# EAGLE board tc08-3-21 (EAGLE 6.6.0), part 1 of 10
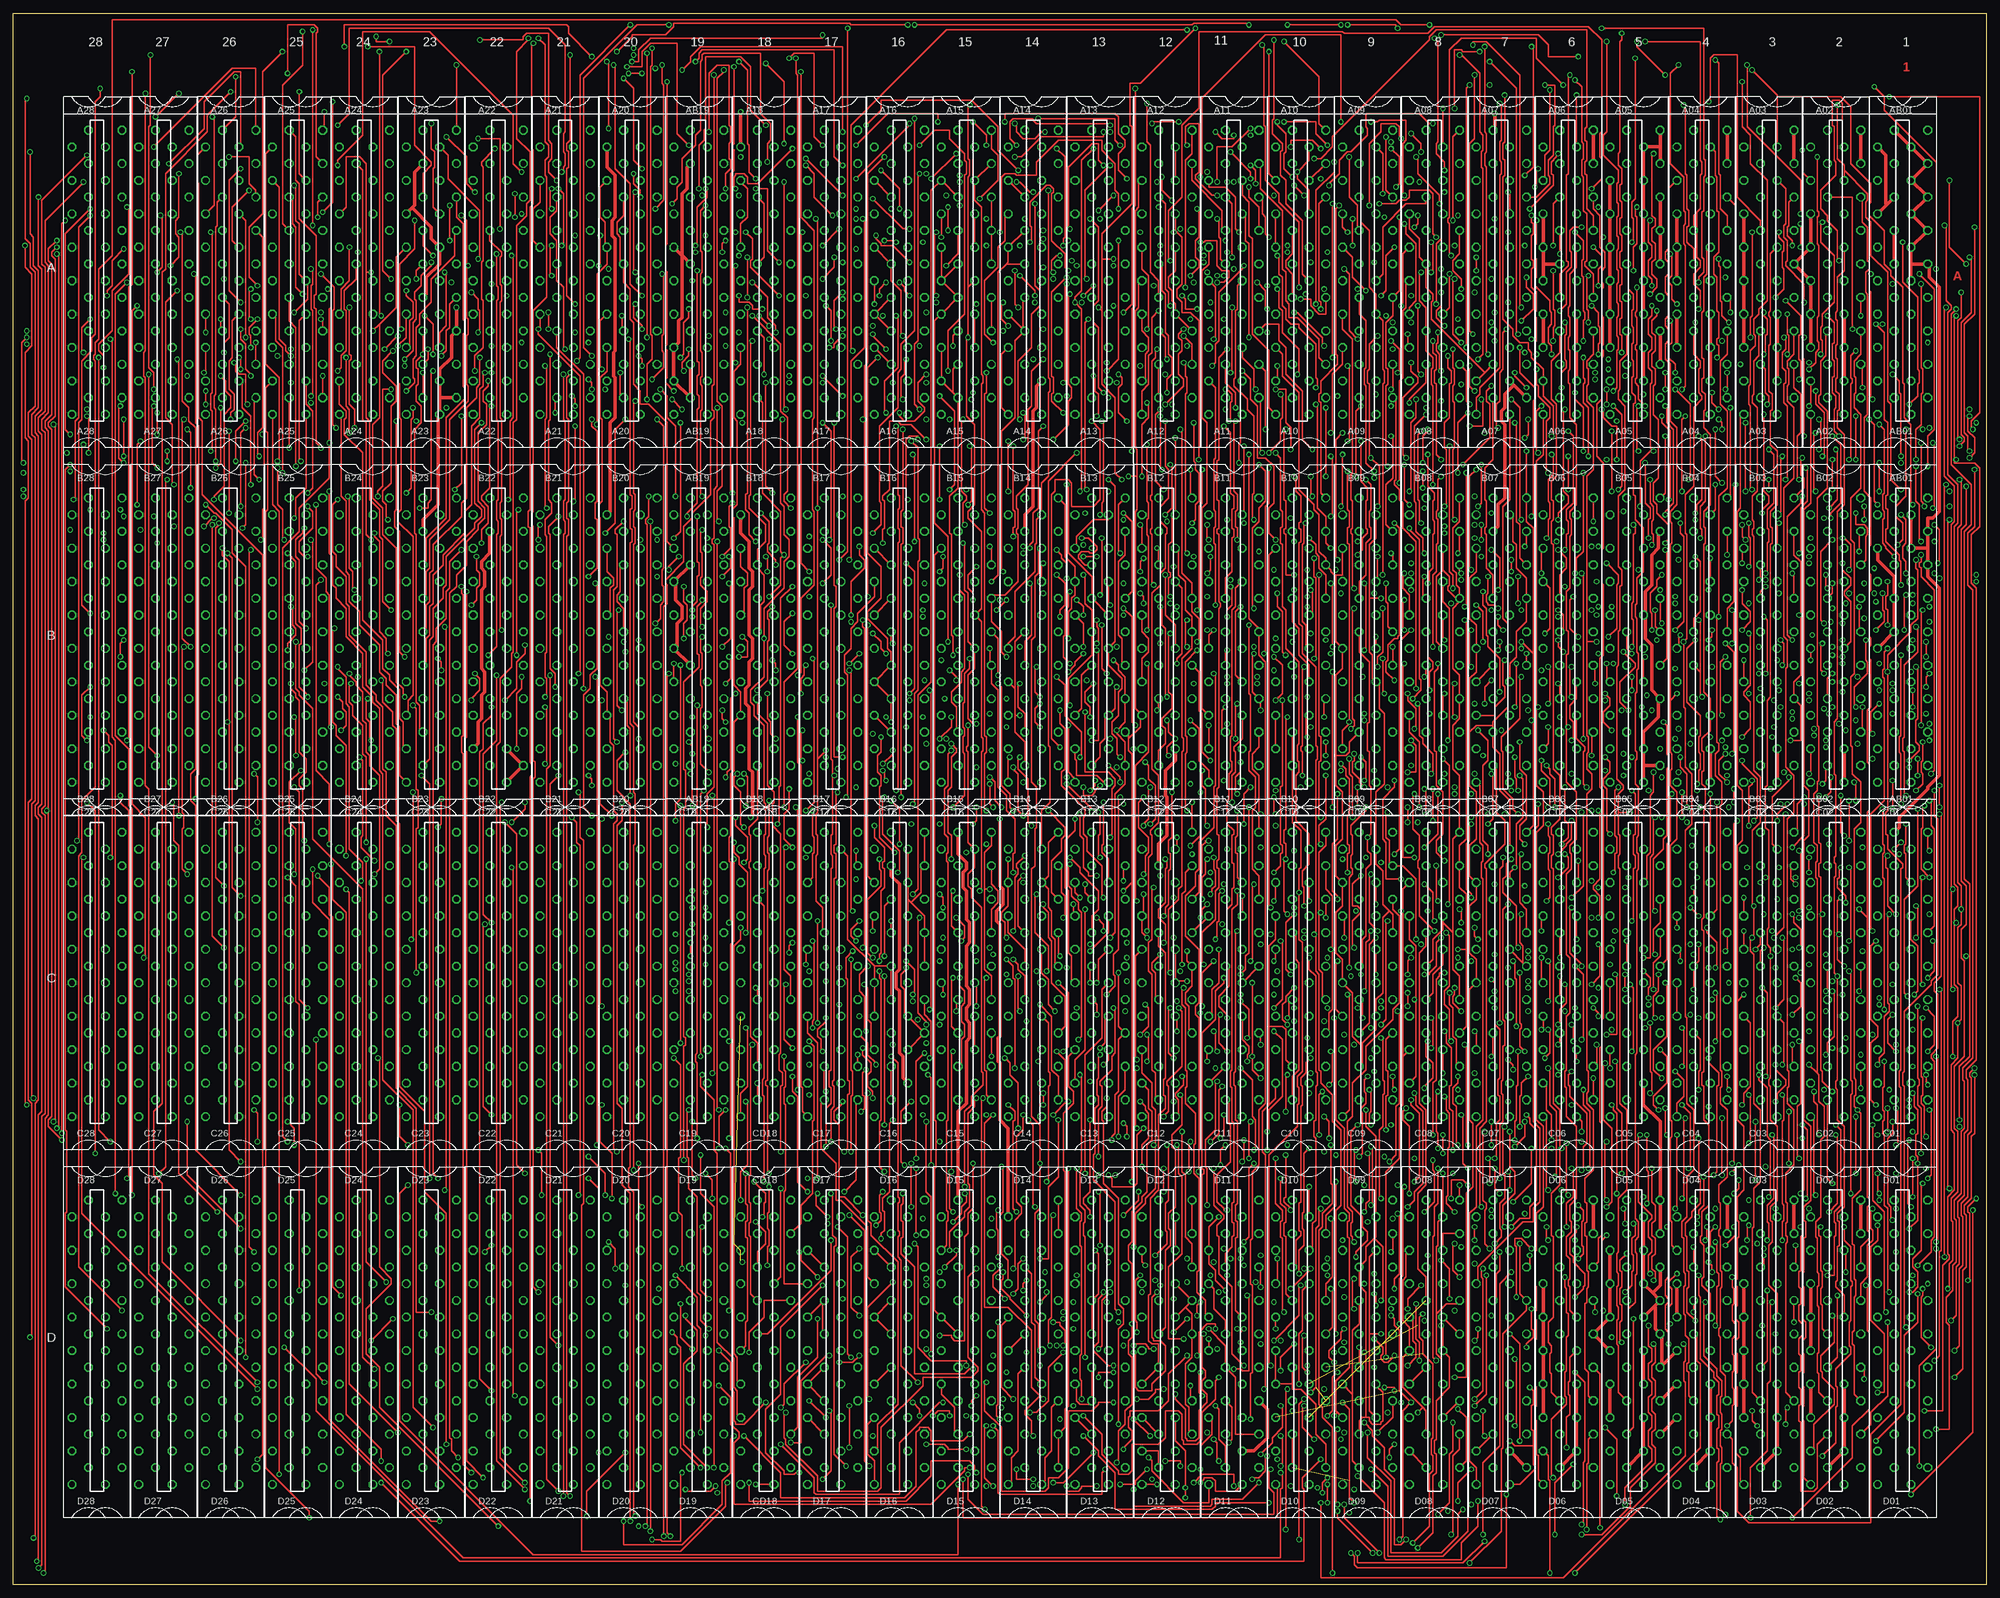
[diagram p12: board, top side]
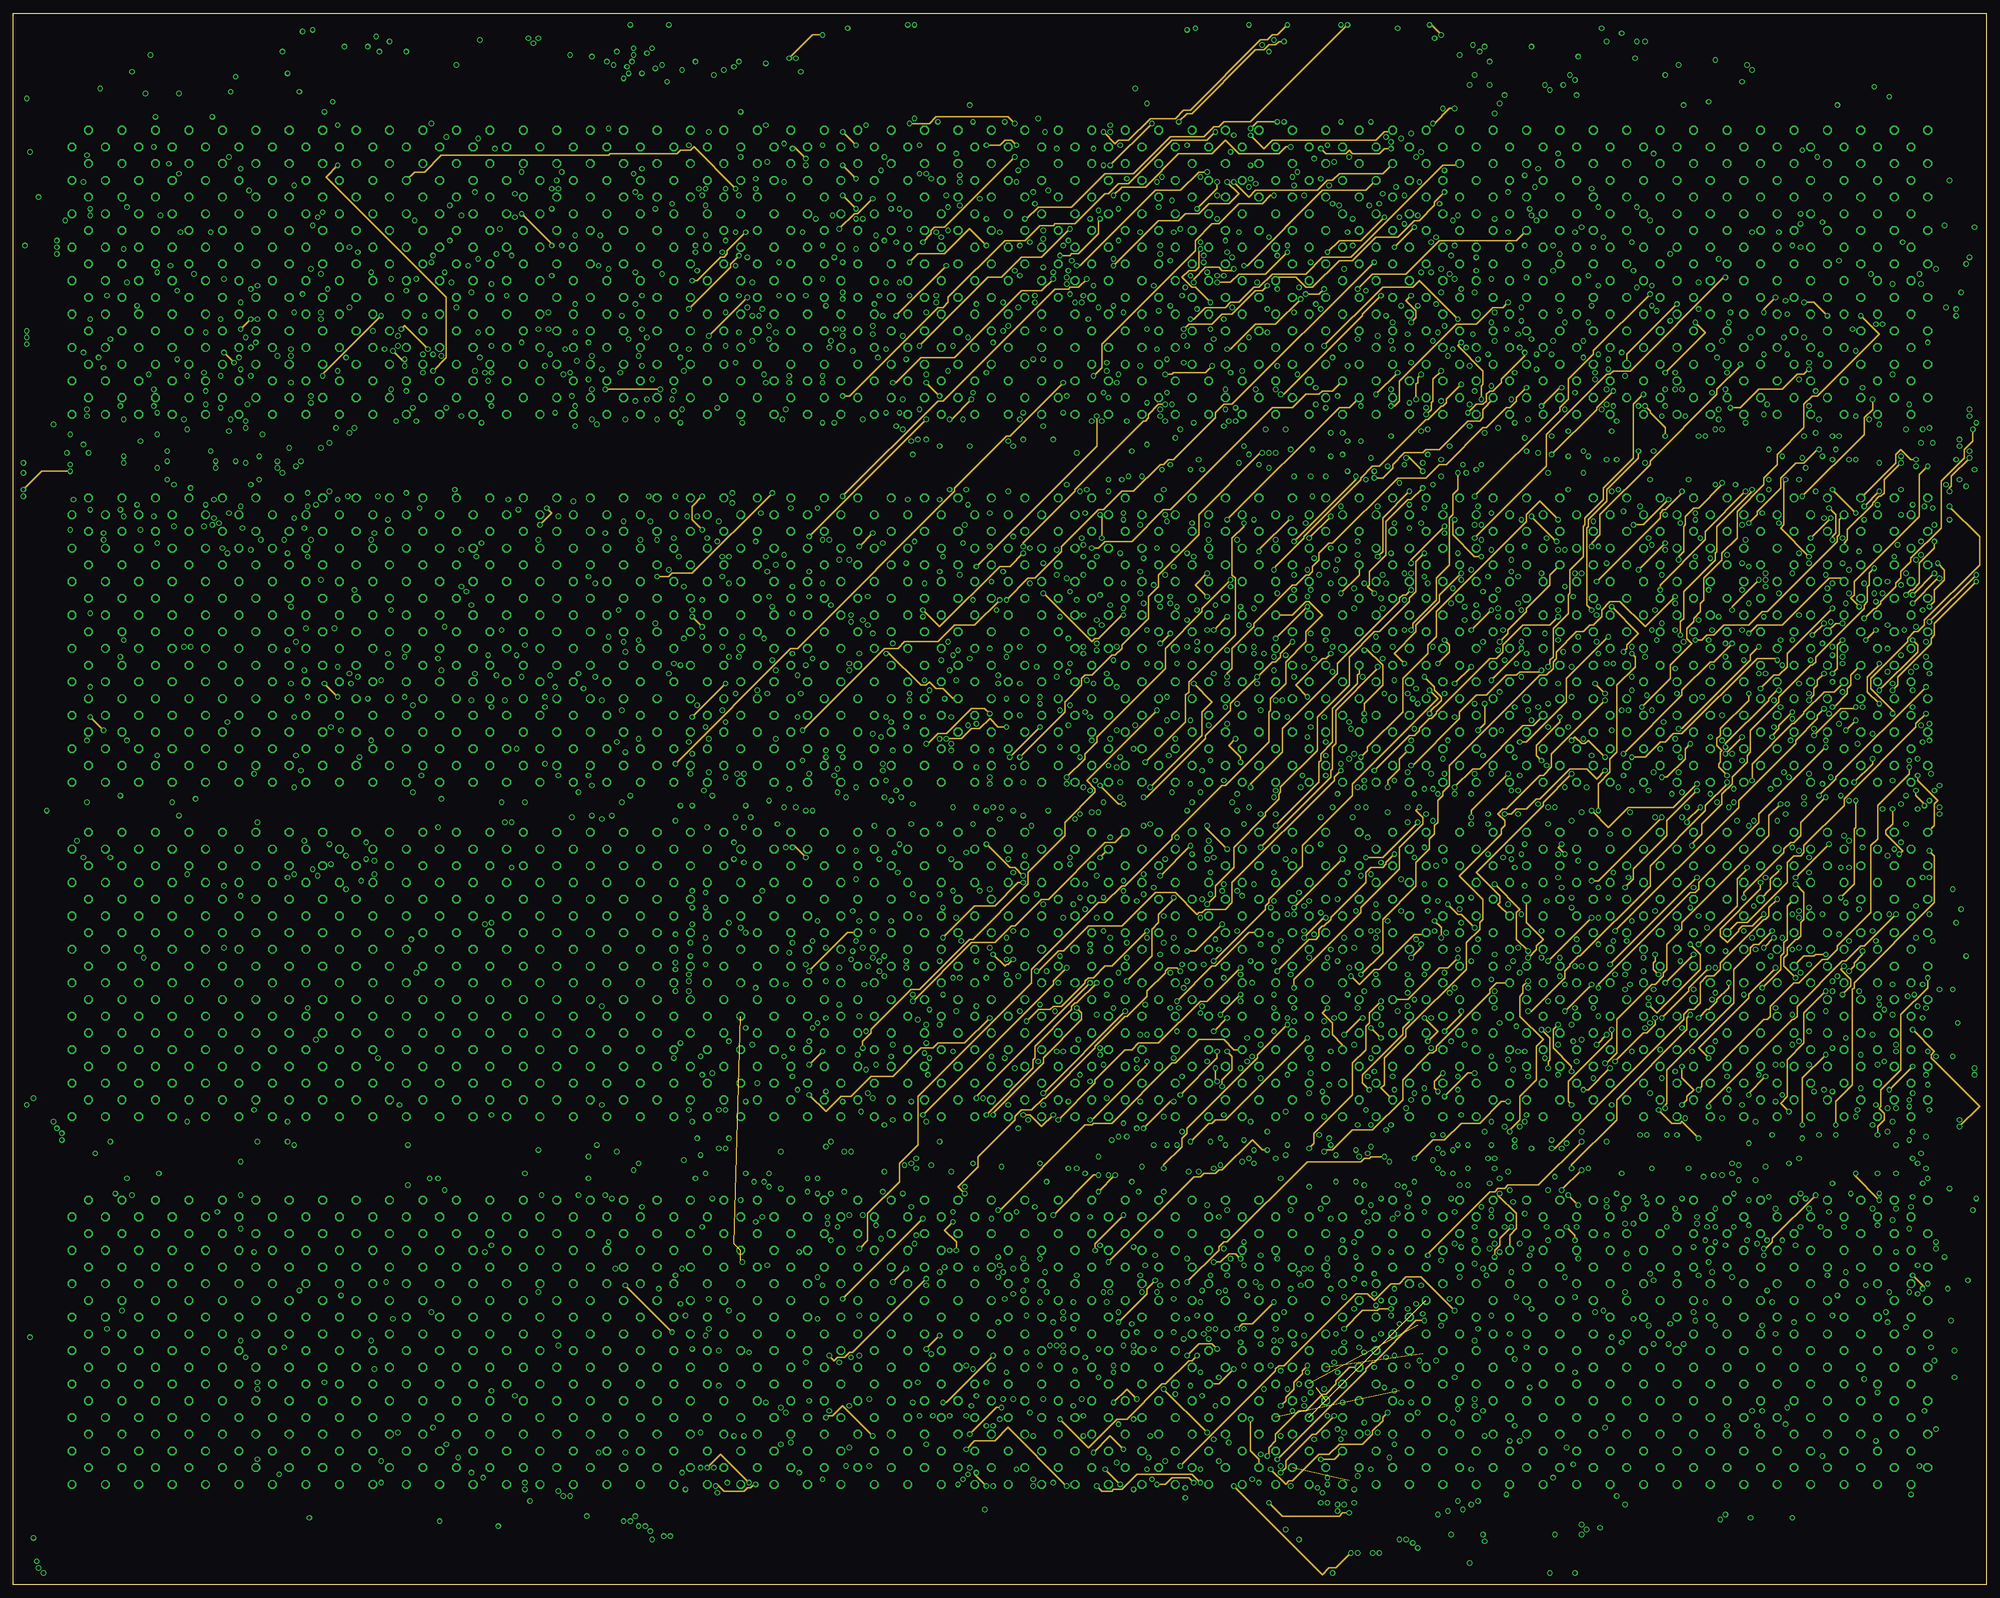
[diagram p13: board, inner layer Route2]
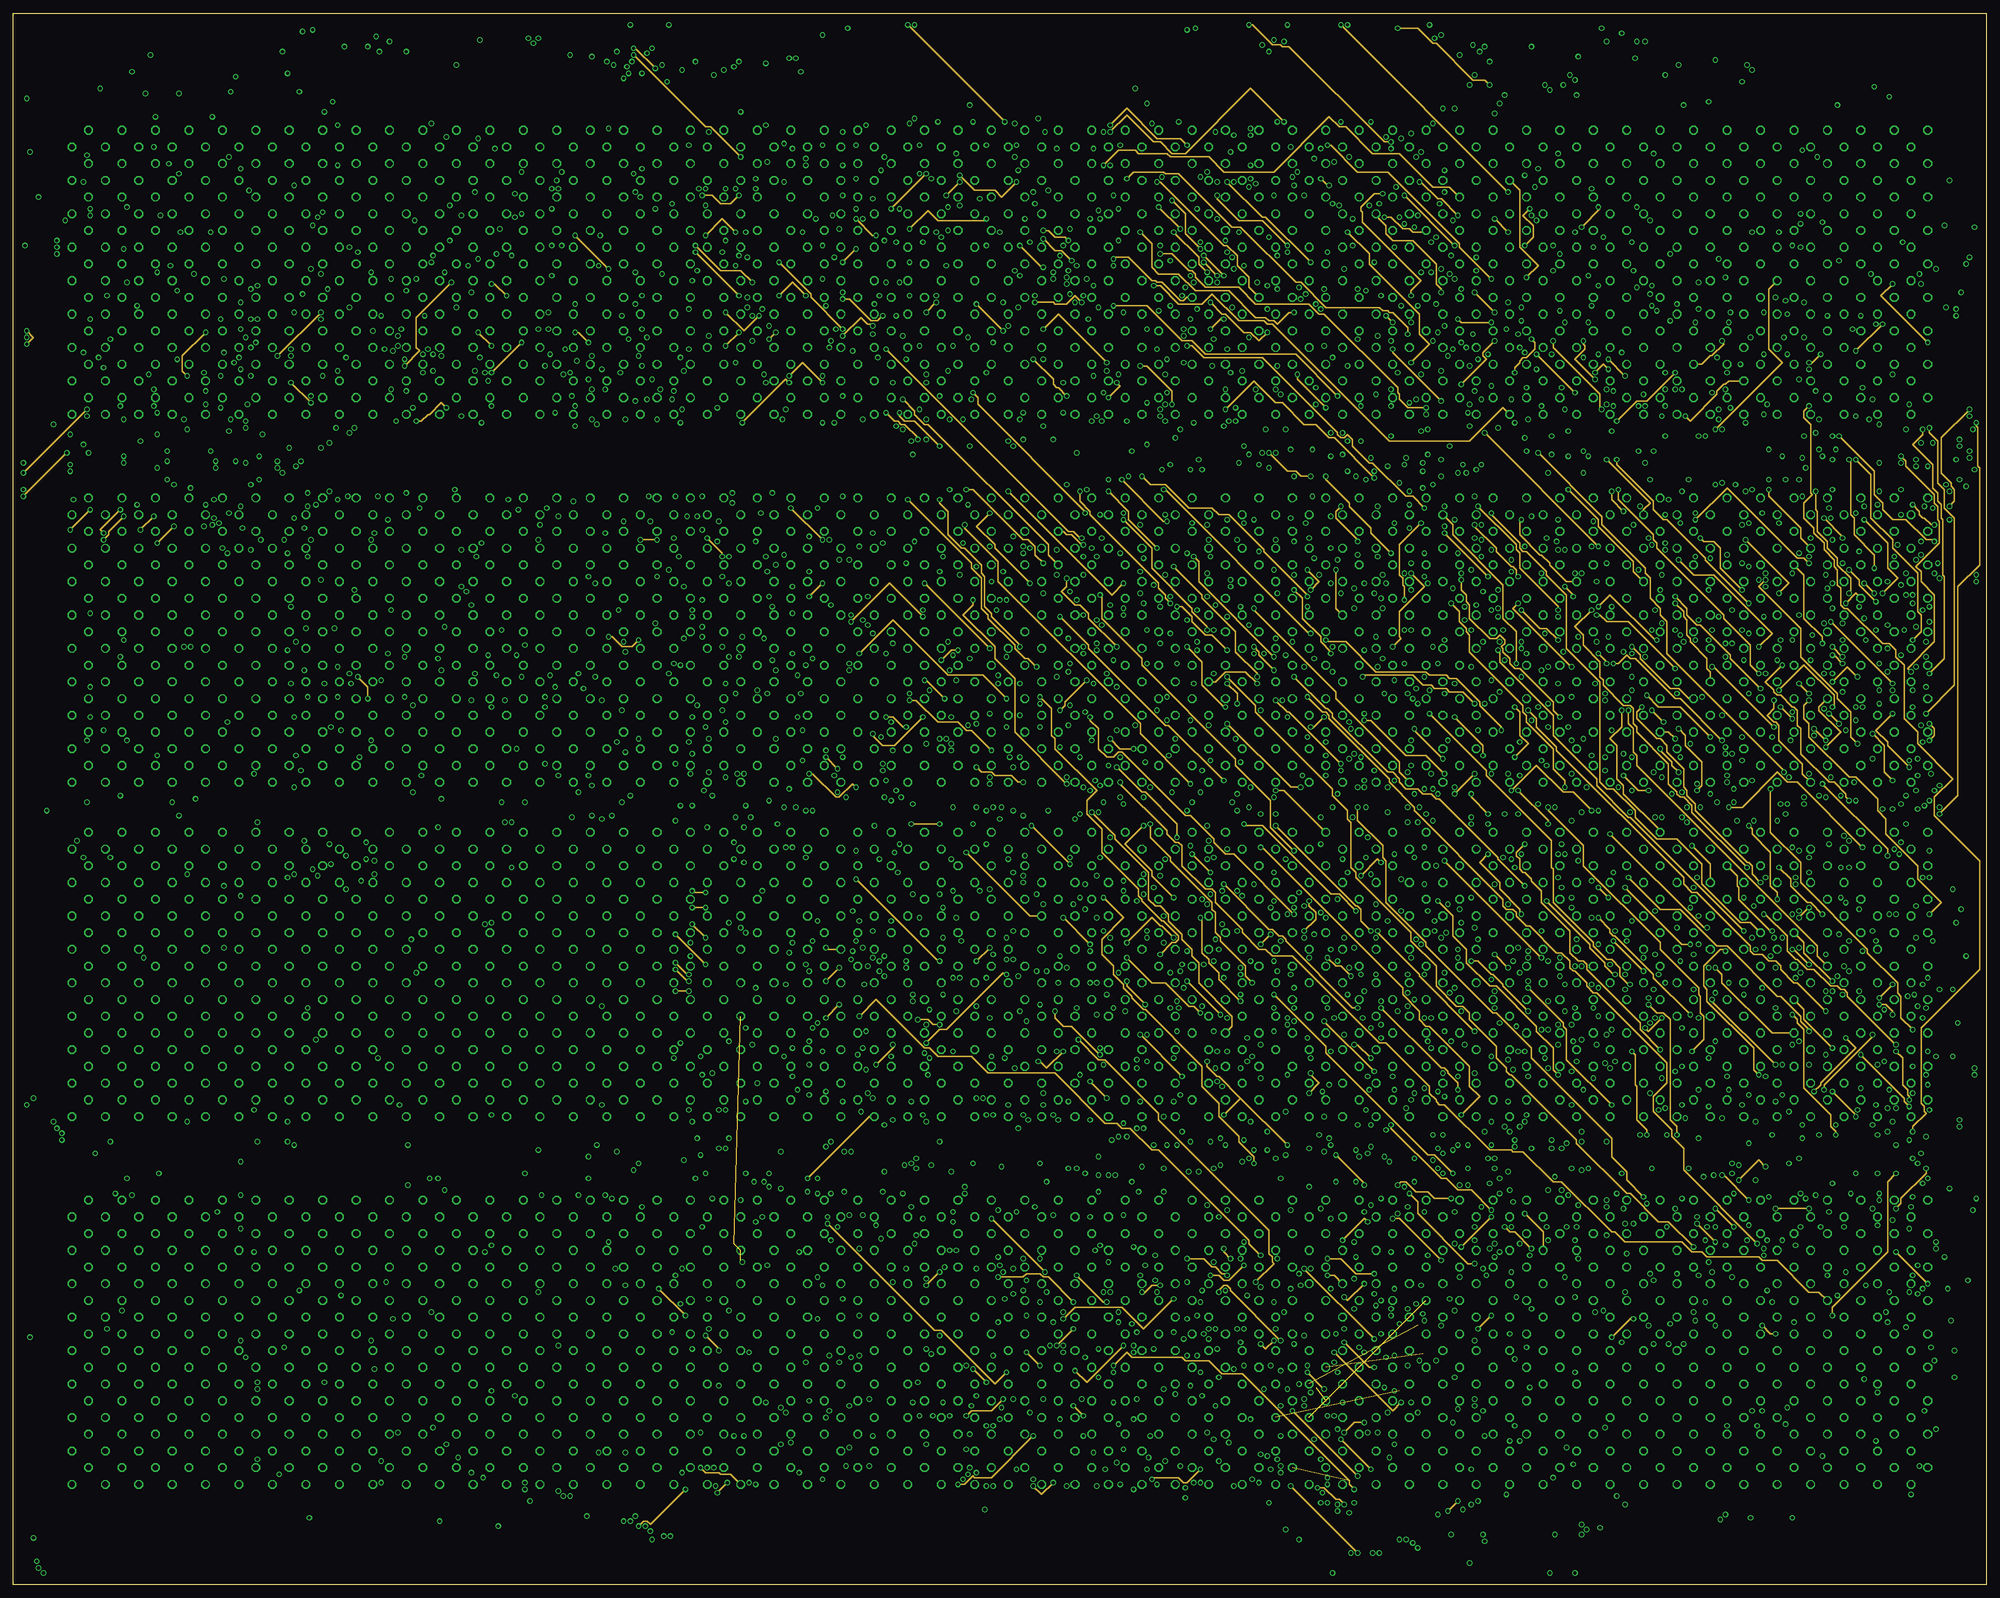
[diagram p14: board, inner layer Route15]
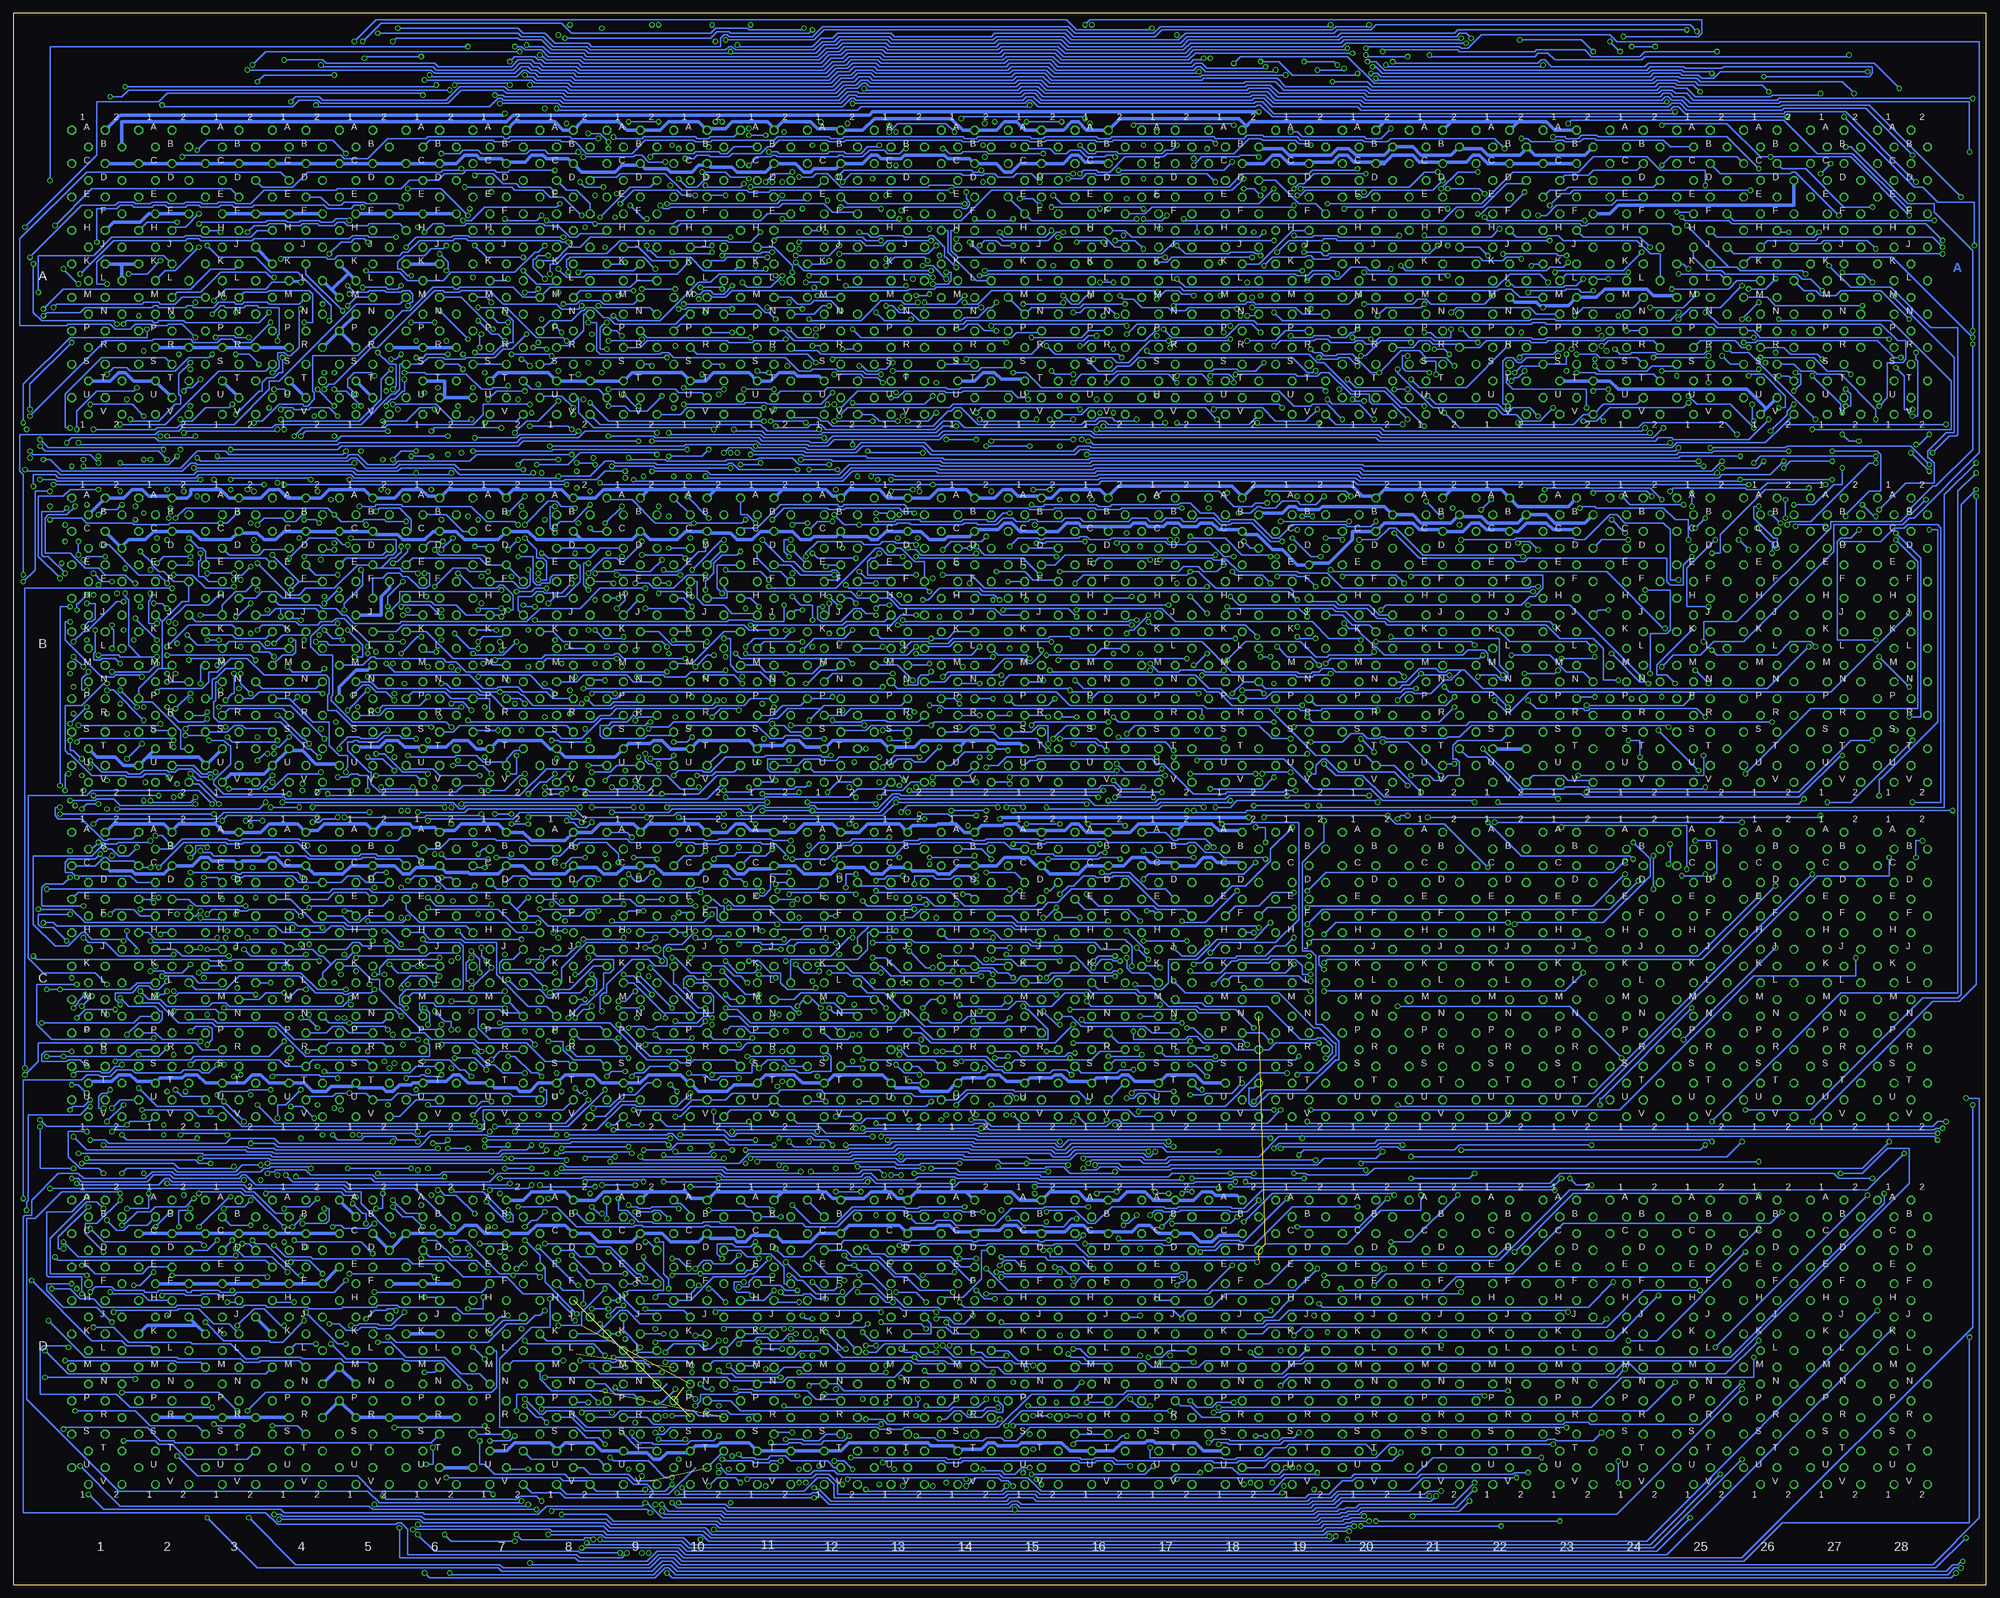
[diagram p15: board, bottom side, seen from below]

Size 374.71 x 298.44 mm. Coordinates in mm from the lower left corner, seen from the top.
Outline: 374.68,0 0,0 0.03,298.42 374.71,298.44 374.68,0
Copper layers (1*2*15*16): Top 0.035mm / dielectric 1.5mm / Route2 0.035mm / dielectric 0.15mm / Route15 0.035mm / dielectric 0.2mm / Bottom 0.035mm
Design rules "10mils": minimum track width 10mil, minimum drill 24mil, track to track 10mil, track to pad 10mil, pad to pad 10mil, via to via 10mil, smd to smd 10mil, copper to edge 40mil, drill to drill 10mil, minimum pad ring 10mil, minimum via ring 8mil, stop-mask expansion 0mil, vias tented up to drill 0mil, thermal gap 10mil
Net classes: 1 Power: width 0.635 mm, drill 0.381 mm, clearance 0.381 mm

## Footprints (pad centres in the part's own frame; a part is rotated, then mirrored left to right if it is on the bottom)
H807 = drill 1.092 octagon: A1 4.763,28.575; A2 -1.587,28.575; B1 1.587,25.4; B2 -4.763,25.4; C1 4.763,22.225; C2 -1.587,22.225; D1 1.587,19.05; D2 -4.763,19.05; E1 4.763,15.875; E2 -1.587,15.875; F1 1.587,12.7; F2 -4.763,12.7; H1 4.763,9.525; H2 -1.587,9.525; J1 1.587,6.35; J2 -4.763,6.35; K1 4.763,3.175; K2 -1.587,3.175; L1 1.587,0; L2 -4.763,0; M1 4.763,-3.175; M2 -1.587,-3.175; N1 1.587,-6.35; N2 -4.763,-6.35; P1 4.763,-9.525; P2 -1.587,-9.525; R1 1.587,-12.7; R2 -4.763,-12.7; S1 4.763,-15.875; S2 -1.587,-15.875; T1 1.587,-19.05; T2 -4.763,-19.05; U1 4.763,-22.225; U2 -1.587,-22.225; V1 1.587,-25.4; V2 -4.763,-25.4
H807-2 = drill 1.092 octagon: AA1 4.763,60.325; AA2 -1.587,60.325; AB1 1.587,57.15; AB2 -4.763,57.15; AC1 4.763,53.975; AC2 -1.587,53.975; AD1 1.587,50.8; AD2 -4.763,50.8; AE1 4.763,47.625; AE2 -1.587,47.625; AF1 1.587,44.45; AF2 -4.763,44.45; AH1 4.763,41.275; AH2 -1.587,41.275; AJ1 1.587,38.1; AJ2 -4.763,38.1; AK1 4.763,34.925; AK2 -1.587,34.925; AL1 1.587,31.75; AL2 -4.763,31.75; AM1 4.763,28.575; AM2 -1.587,28.575; AN1 1.587,25.4; AN2 -4.763,25.4; AP1 4.763,22.225; AP2 -1.587,22.225; AR1 1.587,19.05; AR2 -4.763,19.05; AS1 4.763,15.875; AS2 -1.587,15.875; AT1 1.587,12.7; AT2 -4.763,12.7; AU1 4.763,9.525; AU2 -1.587,9.525; AV1 1.587,6.35; AV2 -4.763,6.35; BA1 4.763,-9.525; BA2 -1.587,-9.525; BB1 1.587,-12.7; BB2 -4.763,-12.7; BC1 4.763,-15.875; BC2 -1.587,-15.875; BD1 1.587,-19.05; BD2 -4.763,-19.05; BE1 4.763,-22.225; BE2 -1.587,-22.225; BF1 1.587,-25.4; BF2 -4.763,-25.4; BH1 4.763,-28.575; BH2 -1.587,-28.575; BJ1 1.587,-31.75; BJ2 -4.763,-31.75; BK1 4.763,-34.925; BK2 -1.587,-34.925; BL1 1.587,-38.1; BL2 -4.763,-38.1; BM1 4.763,-41.275; BM2 -1.587,-41.275; BN1 1.587,-44.45; BN2 -4.763,-44.45; BP1 4.763,-47.625; BP2 -1.587,-47.625; BR1 1.587,-50.8; BR2 -4.763,-50.8; BS1 4.763,-53.975; BS2 -1.587,-53.975; BT1 1.587,-57.15; BT2 -4.763,-57.15; BU1 4.763,-60.325; BU2 -1.587,-60.325; BV1 1.587,-63.5; BV2 -4.763,-63.5

## Placement (x,y rotation side)
A02  M903  [H807]  346.11,247.64 0 top
A03  M903  [H807]  333.41,247.64 0 top
A04  M903  [H807]  320.71,247.64 0 top
A05  M903  [H807]  308.01,247.64 0 top
A06  M903  [H807]  295.31,247.64 0 top
A07  M161  [H807]  282.61,247.64 0 top
A08  M206  [H807]  269.91,247.64 0 top
A09  M117  [H807]  257.21,247.64 0 top
A10  M113  [H807]  244.51,247.64 0 top
A11  M111  [H807]  231.81,247.64 0 top
A12  M113  [H807]  219.11,247.64 0 top
A13  H807  [H807]  206.41,247.64 0 top
A14  M302  [H807]  193.71,247.64 0 top
A15  M627  [H807]  181.01,247.64 0 top
A16  M602  [H807]  168.31,247.64 0 top
A17  H807  [H807]  155.61,247.64 0 top
A18  G888  [H807]  142.91,247.64 0 top
A20  G888  [H807]  117.51,247.64 0 top
A21  G888  [H807]  104.81,247.64 0 top
A22  M502  [H807]  92.11,247.64 0 top
A23  M633  [H807]  79.41,247.64 0 top
A24  W023  [H807]  66.71,247.64 0 top
A25  M916  [H807]  54.01,247.64 0 top
A26  M916  [H807]  41.31,247.64 0 top
A27  H807  [H807]  28.61,247.64 0 top
A28  H807  [H807]  15.91,247.64 0 top
AB01  G821  [H807-2]  358.81,215.89 0 top
AB19  W032  [H807-2]  130.21,215.89 0 top
B02  M623  [H807]  346.11,177.79 0 top
B03  M623  [H807]  333.41,177.79 0 top
B04  M623  [H807]  320.71,177.79 0 top
B05  M623  [H807]  308.01,177.79 0 top
B06  M111  [H807]  295.31,177.79 0 top
B07  M207  [H807]  282.61,177.79 0 top
B08  M113  [H807]  269.91,177.79 0 top
B09  M206  [H807]  257.21,177.79 0 top
B10  M627  [H807]  244.51,177.79 0 top
B11  M115  [H807]  231.81,177.79 0 top
B12  M117  [H807]  219.11,177.79 0 top
B13  M206  [H807]  206.41,177.79 0 top
B14  M206  [H807]  193.71,177.79 0 top
B15  M113  [H807]  181.01,177.79 0 top
B16  M602  [H807]  168.31,177.79 0 top
B17  H807  [H807]  155.61,177.79 0 top
B18  G888  [H807]  142.91,177.79 0 top
B20  G888  [H807]  117.51,177.79 0 top
B21  G879  [H807]  104.81,177.79 0 top
B22  M633  [H807]  92.11,177.79 0 top
B23  W005  [H807]  79.41,177.79 0 top
B24  H807  [H807]  66.71,177.79 0 top
B25  H807  [H807]  54.01,177.79 0 top
B26  H807  [H807]  41.31,177.79 0 top
B27  H807  [H807]  28.61,177.79 0 top
B28  H807  [H807]  15.91,177.79 0 top
C01  M101  [H807]  358.81,114.29 0 top
C02  M101  [H807]  346.11,114.29 0 top
C03  M101  [H807]  333.41,114.29 0 top
C04  M103  [H807]  320.71,114.29 0 top
C05  M103  [H807]  308.01,114.29 0 top
C06  M111  [H807]  295.31,114.29 0 top
C07  M207  [H807]  282.61,114.29 0 top
C08  M121  [H807]  269.91,114.29 0 top
C09  M206  [H807]  257.21,114.29 0 top
C10  M121  [H807]  244.51,114.29 0 top
C11  M113  [H807]  231.81,114.29 0 top
C12  M115  [H807]  219.11,114.29 0 top
C13  M111  [H807]  206.41,114.29 0 top
C14  M206  [H807]  193.71,114.29 0 top
C15  M113  [H807]  181.01,114.29 0 top
C16  M627  [H807]  168.31,114.29 0 top
C17  M111  [H807]  155.61,114.29 0 top
C19  H807  [H807]  130.21,114.29 0 top
C20  H807  [H807]  117.51,114.29 0 top
C21  H807  [H807]  104.81,114.29 0 top
C22  H807  [H807]  92.11,114.29 0 top
C23  H807  [H807]  79.41,114.29 0 top
C24  H807  [H807]  66.71,114.29 0 top
C25  H807  [H807]  54.01,114.29 0 top
C26  H807  [H807]  41.31,114.29 0 top
C27  H807  [H807]  28.61,114.29 0 top
C28  H807  [H807]  15.91,114.29 0 top
CD18  M228  [H807-2]  142.91,82.54 0 top
D01  H807  [H807]  358.81,44.44 0 top
D02  M903  [H807]  346.11,44.44 0 top
D03  M903  [H807]  333.41,44.44 0 top
D04  M903  [H807]  320.71,44.44 0 top
D05  M903  [H807]  308.01,44.44 0 top
D06  M903  [H807]  295.31,44.44 0 top
D07  M161  [H807]  282.61,44.44 0 top
D08  M207  [H807]  269.91,44.44 0 top
D09  M121  [H807]  257.21,44.44 0 top
D10  M119  [H807]  244.51,44.44 0 top
D11  M206  [H807]  231.81,44.44 0 top
D12  M627  [H807]  219.11,44.44 0 top
D13  M602  [H807]  206.41,44.44 0 top
D14  M307  [H807]  193.71,44.44 0 top
D15  M401  [H807]  181.01,44.44 0 top
D16  M302  [H807]  168.31,44.44 0 top
D17  M602  [H807]  155.61,44.44 0 top
D19  H807  [H807]  130.21,44.44 0 top
D20  H807  [H807]  117.51,44.44 0 top
D21  H807  [H807]  104.81,44.44 0 top
D22  H807  [H807]  92.11,44.44 0 top
D23  H807  [H807]  79.41,44.44 0 top
D24  H807  [H807]  66.71,44.44 0 top
D25  H807  [H807]  54.01,44.44 0 top
D26  H807  [H807]  41.31,44.44 0 top
D27  H807  [H807]  28.61,44.44 0 top
D28  H807  [H807]  15.91,44.44 0 top
U$17  [CBLOCK]  9.56,12.69 0 top
U$18  [CBLOCK]  60.36,12.69 0 top
U$19  [CBLOCK]  111.16,12.69 0 top
U$20  [CBLOCK]  161.96,12.69 0 top
U$66  [CBLOCK]  212.76,12.69 0 top
U$67  [CBLOCK]  263.56,12.69 0 top
U$68  [CBLOCK]  314.36,12.69 0 top
U$69  [CBLOCK]  314.36,146.04 0 top
U$70  [CBLOCK]  263.56,146.04 0 top
U$71  [CBLOCK]  212.76,146.04 0 top
U$72  [CBLOCK]  161.96,146.04 0 top
U$73  [CBLOCK]  111.16,146.04 0 top
U$74  [CBLOCK]  60.36,146.04 0 top
U$75  [CBLOCK]  9.56,146.04 0 top

## Tracks (layer width: path | path; a pad name or v marks a point on that pad's centre or on a via)
0_TO_DTB  (via drill 0.61)
  Top 0.254: v187.04,71.11 186.73,70.79 186.73,67.61 187.04,67.3 v187.04,62.22 | v167.04,57.46 162.28,52.69 162.28,35.55 v162.6,35.23 | v158.79,26.02 v158.79,33.96 | v116.24,25.07 108.94,17.77 v108.94,13.01 | v46.39,37.14 13.05,70.47 13.05,137.78 v13.37,138.1 | v12.1,141.27 12.42,141.59 12.42,220.65 13.05,221.29 13.05,232.4 14.96,234.3 14.96,236.84 15.59,237.48 15.59,281.61 16.55,282.56 v16.55,284.15 | v112.75,289.23 113.07,288.91 v113.07,276.53 | v132.12,275.9 132.12,287.01 133.7,288.6 135.93,288.6 135.93,277.17 136.24,276.85 136.24,273.99 135.93,273.67 135.93,270.81 136.24,270.5 136.24,268.91 135.29,267.96 v135.29,265.1
  Route2 0.254: C11.R1 231.81,101.59 229.91,103.49 225.14,103.49 220.7,99.05 220.06,99.05 208.63,87.62 205.14,87.62 204.82,87.3 203.55,87.3 187.36,71.11 v187.04,71.11 | v167.04,57.46 v169.58,60
  Route15 0.254: v179.74,266.37 v177.2,263.83 | v217.21,266.37 217.84,266.37 229.91,254.3 230.54,254.3 232.45,252.4 232.45,250.49 234.67,248.27 234.67,246.37 A11.M1
  Bottom 0.254: v187.04,62.22 178.79,62.22 178.15,61.58 171.8,61.58 170.22,60 v169.58,60 | v162.6,35.23 161.01,33.64 159.1,33.64 v158.79,33.96 | v158.79,26.02 158.79,24.12 145.13,24.12 144.82,23.8 142.59,23.8 142.28,24.12 137.2,24.12 135.29,26.02 133.07,26.02 132.43,26.66 117.83,26.66 v116.24,25.07 | v108.94,13.01 108.62,13.32 70.2,13.32 v46.39,37.14 | v13.37,138.1 13.37,141.27 v12.1,141.27 | v16.55,284.15 21.31,288.91 64.17,288.91 64.81,288.28 82.59,288.28 83.86,289.55 84.49,289.55 85.13,288.91 112.43,288.91 v112.75,289.23 | v113.07,276.53 114.97,274.62 117.83,274.62 118.15,274.94 129.89,274.94 130.85,275.9 v132.12,275.9 | v135.29,265.1 138.15,262.24 175.61,262.24 v177.2,263.83 | v179.74,266.37 181.33,267.96 184.19,267.96 184.82,267.32 187.68,267.32 188.31,267.96 190.22,267.96 190.54,267.64 194.35,267.64 194.66,267.96 215.62,267.96 v217.21,266.37
0_TO_EF  (via drill 0.61)
  Top 0.254: A11.E2 231.49,262.24 v231.49,252.08
  Bottom 0.254: v231.49,252.08 239.11,252.08 239.75,251.45 242.29,251.45 A10.K2
0_TO_STA
  Bottom 0.254: A10.N2 A11.N1
1_TO_DF  (via drill 0.61)
  Top 0.254: C12.J1 220.7,114.61 | v227.05,46.66 D11.L2 | v222.29,46.66 219.43,46.66 219.43,60.31 221.97,62.85 221.97,77.46 221.33,78.09 221.33,83.17 v221.02,83.49 | v227.37,84.13 228.95,85.71 228.95,93.97 v229.59,94.6 | v230.54,101.27 228.95,102.86 228.95,107.94 v229.27,108.25 | 220.7,114.61 v222.92,114.61 | 220.7,114.61 C12.L1 | A08.H1 274.67,252.72 273.4,251.45 273.4,249.54 274.99,247.96 v274.99,246.05 | v276.26,222.55 274.36,220.65 v274.36,211.12 | v265.47,181.28 263.24,179.06 263.24,139.69 v262.29,138.74
  Route2 0.254: v229.59,94.6 229.59,95.87 231.49,97.78 231.49,100.32 v230.54,101.27 | v287.06,233.99 287.06,233.35 282.61,228.9 282.61,228.27 281.02,226.68 280.39,226.68 279.75,226.05 279.75,224.78 279.12,224.14 277.85,224.14 v276.26,222.55 | v274.36,211.12 274.36,207.95 273.4,207 273.4,203.19 272.77,202.55 272.77,193.66 270.23,191.12 270.23,186.99 265.78,182.55 265.78,181.6 v265.47,181.28 | v262.29,138.74 260.7,137.15 260.7,136.83 260.07,136.2 257.85,136.2 256.89,135.24 256.89,133.34 250.23,126.67 250.23,126.35 248.96,125.08 248.64,125.08 248,124.45 248,123.18 247.37,122.54 246.1,122.54 v240.07,116.51 | v229.27,108.25 v233.08,112.07
  Route15 0.254: v222.92,114.61 v229.27,108.25 | v281.34,241.61 v277.53,245.42
  Bottom 0.254: v227.05,46.66 226.73,46.34 222.6,46.34 v222.29,46.66 | v221.02,83.49 221.33,83.17 226.41,83.17 v227.37,84.13 | v274.99,246.05 275.63,245.42 v277.53,245.42 | v281.34,241.61 279.75,240.02 279.75,235.89 280.39,235.89 281.02,235.26 281.98,235.26 283.56,233.67 286.74,233.67 v287.06,233.99 | v240.07,116.51 235.62,112.07 v233.08,112.07
1_TO_DTF  (via drill 0.61)
  Top 0.254: v218.48,37.14 216.89,37.14 216.89,36.5 215.62,35.23 v213.4,35.23 | v208.95,34.6 206.09,34.6 206.09,34.28 204.82,33.01 200.38,33.01 200.38,22.21 198.47,20.31 196.57,20.31 196.57,18.4 195.93,17.77 187.68,17.77 187.68,29.83 184.5,33.01 184.5,38.09 v184.82,38.4 | v182.28,40.95 181.65,40.95 180.69,39.99 171.17,39.99 171.17,60.31 168.63,62.85 168.63,65.71 168.95,66.03 168.95,68.88 168.63,69.2 168.63,72.06 168.95,72.38 v168.95,74.28 | v165.14,74.6 164.5,73.97 164.5,70.79 164.82,70.47 164.82,69.2 v163.87,68.25 | v161.33,70.16 157.83,73.65 156.88,73.65 156.88,87.3 155.93,88.25 155.93,89.84 157.52,91.43 v157.52,91.74 | v163.23,92.38 163.23,93.65 162.28,94.6 162.28,96.83 162.91,97.46 162.91,99.05 161.33,100.63 v161.33,101.91 | v217.21,166.04 217.52,166.36 B12.P2
  Route2 0.254: v218.48,37.14 v226.73,28.88 | v213.4,35.23 211.49,37.14 v208.95,34.6 | v161.33,101.91 161.33,103.18 162.91,104.76 162.91,105.4 170.53,113.02 172.12,113.02 181.65,122.54 182.28,122.54 192.76,133.02 192.76,135.24 199.74,142.23 199.74,144.77 205.46,150.48 205.46,151.12 203.87,152.71 v217.21,166.04
  Route15 0.254: v182.28,40.95 v184.82,38.4
  Bottom 0.254: D11.S2 229.91,28.88 v226.73,28.88 | v168.95,74.28 168.63,74.6 v165.14,74.6 | v163.87,68.25 163.55,68.57 162.91,68.57 v161.33,70.16 | v157.52,91.74 159.1,93.33 161.01,93.33 161.96,92.38 v163.23,92.38
76  (via drill 0.61)
  Top 0.254: v315.63,97.46 317.22,95.87 317.22,92.7 315.95,91.43 C04.V2
  Bottom 0.254: C06.S2 298.17,98.41 299.44,97.14 315.31,97.14 v315.63,97.46
76+77  (via drill 0.61)
  Top 0.254: v217.21,19.04 D12.V2 | v224.19,19.35 225.78,20.94 231.81,20.94 v231.81,18.72 | v254.04,6.02 254.67,5.38 254.67,3.8 255.31,3.16 283.56,3.16 v283.56,17.13 | v343.57,24.44 346.11,26.98 346.11,33.64 346.43,33.96 346.43,37.45 346.11,37.77 346.11,40.95 348.97,43.8 348.97,45.07 348.65,45.39 348.65,49.83 348.97,50.15 348.97,56.5 349.29,56.82 349.29,57.46 348.97,57.77 348.97,64.12 347.7,65.39 v347.7,67.93 | v344.84,70.79 346.43,72.38 346.43,85.08 v346.11,85.39 | v337.86,108.25 339.44,109.84 339.44,114.29 v338.49,115.24 | v338.49,133.02 337.54,133.97 337.54,135.88 C03.C1
  Route2 0.254: v217.21,19.04 218.79,19.04 220.06,20.31 223.24,20.31 v224.19,19.35 | v231.81,18.72 248.64,1.89 249.91,3.16 251.18,3.16 v254.04,6.02 | v338.49,115.24 336.27,117.46 336.27,119.05 336.9,119.69 336.9,120.96 338.49,122.54 338.81,122.54 339.44,123.18 339.44,125.72 340.08,126.35 340.08,131.43 v338.49,133.02
  Route15 0.254: v346.11,85.39 346.11,86.03 345.16,86.98 345.16,89.21 340.08,94.28 340.08,105.4 338.81,106.67 338.81,107.3 v337.86,108.25
  Bottom 0.254: v283.56,17.13 284.2,17.77 306.42,17.77 309.28,20.62 339.76,20.62 v343.57,24.44 | v344.84,70.79 v347.7,67.93
77
  Bottom 0.254: C06.U2 298.17,92.06 301.34,88.89 C05.V2
!00  (via drill 0.61)
  Top 0.254: v109.26,153.66 109.89,153.02 v109.89,151.75 | v128.62,153.98 128.94,153.66 v128.94,147.94 | v139.1,147.94 139.42,148.26 139.42,153.34 v138.78,153.98 | v165.77,152.71 165.45,153.02 165.45,154.29 v165.14,154.61 | v286.42,240.02 288.64,242.24 288.64,245.1 287.37,246.37 v287.37,248.27
  Route2 0.254: v200.06,153.34 203.55,156.83 203.55,157.79 205.78,160.01 205.78,160.96 218.79,173.98 218.79,177.79 225.78,184.77 225.78,185.41 v231.18,190.8 | v239.43,192.71 239.43,193.03 245.15,198.74 245.15,199.06 255.94,209.86 255.94,210.17 258.16,212.39 259.43,212.39 268.32,221.29 268.64,221.29 271.18,223.83 271.5,223.83 272.13,224.46 272.13,225.09 v274.99,227.95
  Route15 0.254: v151.17,153.98 151.8,153.98 156.25,149.53 156.88,149.53 159.42,152.07 v160.06,151.43 | v274.99,227.95 279.75,232.71 279.12,233.35 279.12,233.99 v281.34,236.21 | v287.37,248.27 289.6,250.49 286.1,253.99 286.1,264.78 A07.D1
  Bottom 0.254: B22.S2 92.11,160.33 100.37,160.33 101.32,159.37 101.32,156.83 100.68,156.83 100.05,156.2 100.05,153.66 102.27,153.66 103.22,152.71 104.81,152.71 105.76,153.66 v109.26,153.66 | v109.89,151.75 112.43,154.29 122.91,154.29 125.45,156.83 126.08,156.83 127.35,155.56 127.35,153.98 v128.62,153.98 | v139.1,147.94 v128.94,147.94 | v151.17,153.98 v138.78,153.98 | v160.06,151.43 160.37,151.12 164.18,151.12 v165.77,152.71 | v165.14,154.61 165.45,154.29 192.44,154.29 193.08,153.66 199.74,153.66 v200.06,153.34 | v231.18,190.8 232.76,192.39 239.11,192.39 v239.43,192.71 | v281.34,236.21 282.61,237.48 283.88,237.48 v286.42,240.02
!0_TO_AC  (via drill 0.61)
  Top 0.254: B06.T2 291.5,159.69 v291.5,162.86 | v313.09,182.55 312.77,182.87 B05.H1
  Bottom 0.254: v291.5,162.86 292.45,163.82 310.23,163.82 314.36,167.95 314.36,168.58 314.04,168.9 314.04,176.52 316.58,176.52 318.17,178.11 318.17,180.01 315.95,182.23 313.41,182.23 v313.09,182.55
!0_TO_DTB  (via drill 0.61)
  Top 0.254: C09.K2 256.26,118.1 256.26,122.54 256.89,123.18 256.89,135.88 257.85,136.83 257.85,138.74 257.21,139.37 v257.21,141.91 257.85,142.55 257.85,151.43 257.53,151.75 257.53,158.1 257.21,158.42 257.21,163.5 257.53,163.82 257.53,175.25 255.62,177.15 B09.K2 | v245.46,201.6 245.15,201.28 245.15,197.79 244.83,197.47 244.83,182.87 245.46,182.23 245.46,178.42 B10.L1 | A11.L1 232.45,246.68 232.45,242.24 232.13,241.92 232.13,229.22 231.81,228.9 231.81,227.64 234.35,225.09 234.35,223.19 235.62,221.92 235.62,207.31 235.3,207 235.3,202.55 v235.62,202.24
  Bottom 0.254: v257.21,141.91 258.16,142.86 C09.A1 | B10.L1 246.73,178.42 249.59,178.42 252.13,180.96 B09.K2 | B09.A1 261.66,206.05 257.21,206.05 252.77,201.6 v245.46,201.6 236.26,201.6 v235.62,202.24
!0_TO_EF  (via drill 0.61)
  Top 0.254: v264.2,258.43 264.51,258.11 264.51,256.53 266.42,254.62 266.42,243.83 265.15,242.56 A08.N2 | A08.A1 273.4,274.94 v273.4,259.07
  Bottom 0.254: A11.F2 231.49,260.34 232.76,259.07 248.64,259.07 249.27,258.43 v264.2,258.43 264.51,258.75 273.09,258.75 v273.4,259.07 | A08.R1 271.18,235.26 269.28,235.26 266.42,238.11 266.42,241.29 A08.N2
!0_TO_LPB  (via drill 0.61)
  Top 0.254: v274.67,75.87 D08.A1 | v264.2,75.55 263.88,75.24 263.88,58.72 263.24,58.09 v263.24,49.52
  Bottom 0.254: D12.J2 215.62,49.52 255.62,49.52 258.16,52.06 259.43,52.06 262.61,48.88 | 262.61,48.88 263.88,47.61 D08.K2 | v274.67,75.87 274.36,75.55 v264.2,75.55 | 262.61,48.88 v263.24,49.52
!0_TO_STA  (via drill 0.61)
  Top 0.254: 288.64,163.82 288.64,144.13 C07.A1 | 288.64,176.83 v286.42,179.06 | 288.64,163.82 288.64,176.83 | 288.64,163.82 v288.33,164.14 | 288.64,176.83 288.64,200.65 287.37,201.92 B07.A1 v287.37,215.25 | A11.P1 237.84,239.38 240.38,239.38 240.38,236.21 241.65,234.94 241.65,229.86 244.83,226.68 244.83,217.48 v246.73,215.57
  Bottom 0.254: B11.P2 234.67,168.26 235.94,166.99 241.02,166.99 241.65,166.36 260.07,166.36 261.34,165.09 263.24,165.09 264.51,163.82 288.01,163.82 v288.33,164.14 | B07.K2 281.98,180.01 285.47,180.01 v286.42,179.06 | v246.73,215.57 272.13,215.57 272.45,215.25 v287.37,215.25
!0_TO_STATE  (via drill 0.61)
  Top 0.254: CD18.AV2 138.15,93.33 139.42,94.6 139.42,105.4 v139.1,105.72
  Bottom 0.254: v139.1,105.72 142.59,109.21 149.26,109.21 149.9,109.84 155.29,109.84 157.83,112.38 160.69,112.38 161.33,113.02 168.63,113.02 C16.L1
!0_TO_W  (via drill 0.61)
  Top 0.254: CD18.BH2 140.05,55.23 140.05,66.03 139.74,66.35 139.74,68.57 140.05,68.88 140.05,72.38 139.74,72.69 139.74,77.46 140.05,77.77 140.05,102.22 v140.37,102.54 | v151.8,105.72 151.8,106.99 152.12,107.3 152.12,121.91 v151.8,122.22 | v160.06,122.22 159.1,123.18 159.1,124.45 v160.69,126.03
  Bottom 0.254: v140.37,102.54 141.32,103.49 148.31,103.49 150.53,105.72 v151.8,105.72 | v160.06,122.22 v151.8,122.22 | v160.69,126.03 162.91,128.26 171.17,128.26 C16.E1
!01  (via drill 0.61)
  Top 0.254: v101.64,238.43 v101.64,241.61 | v118.78,233.35 119.42,232.71 v119.42,231.45 | v126.72,233.03 127.35,233.67 127.35,239.7 128.31,240.65 v128.31,242.24 | v156.88,257.48 v153.71,254.3 | v163.23,263.19 168.95,257.48 v170.22,257.48 | v253.4,296.22 262.61,296.22 262.61,295.9 v262.93,295.58 | v290.87,284.79 292.77,284.79 292.77,277.17 292.45,276.85 292.45,271.45 291.5,270.5 291.5,267.64 291.82,267.32 291.82,266.05 289.28,263.51 A07.E1
  Route2 0.254: v128.31,242.24 136.24,250.18 136.24,250.81 v137.83,252.4 | v156.88,257.48 159.74,260.34 160.37,260.34 v163.23,263.19 | v192.12,259.38 192.44,259.38 194.66,261.61 201.01,261.61 207.36,267.96 212.76,267.96 219.75,274.94 226.1,274.94 228,276.85 228.95,276.85 229.91,277.8 234.99,277.8 v253.4,296.22
  Route15 0.254: v106.72,237.8 107.35,237.8 v109.26,235.89 | v170.22,257.48 173.71,260.97 175.61,259.07 184.5,259.07 v184.82,259.38 | v262.93,295.58 266.74,295.58 269.59,292.72 270.23,292.72 277.21,285.74 279.44,285.74 v280.39,284.79
  Bottom 0.254: A23.N1 85.44,241.29 86.71,242.56 100.68,242.56 v101.64,241.61 | v101.64,238.43 101.64,236.84 104.49,236.84 105.45,237.8 v106.72,237.8 | v109.26,235.89 109.57,236.21 114.97,236.21 117.83,233.35 v118.78,233.35 | v119.42,231.45 121,233.03 122.91,233.03 123.23,232.71 126.4,232.71 v126.72,233.03 | v137.83,252.4 138.15,252.72 138.78,252.72 139.1,253.04 143.55,253.04 143.86,252.72 152.12,252.72 v153.71,254.3 | v184.82,259.38 185.14,259.07 191.81,259.07 v192.12,259.38 | v280.39,284.79 280.71,285.1 290.55,285.1 v290.87,284.79
!02  (via drill 0.61)
  Top 0.254: A07.J1 283.88,254.3 v283.88,256.85 | v262.61,265.42 263.24,266.05 263.24,271.13 v261.66,272.72 | v248.32,272.72 246.73,274.31 242.61,274.31 v242.61,273.04 | v206.09,260.97 v208.95,263.83 | v193.71,264.47 193.08,264.47 191.17,266.37 v190.54,266.37 | v150.53,270.81 v157.52,263.83 | v147.99,272.72 141.32,266.05 139.42,266.05 139.42,267.32 138.78,267.96 137.2,267.96 137.2,267.64 136.88,267.32 136.88,265.42 v137.2,265.1
  Route2 0.254: v261.66,272.72 260.39,272.72 259.43,271.77 254.35,271.77 253.72,272.4 253.08,271.77 249.27,271.77 v248.32,272.72 | v242.61,273.04 241.65,273.04 240.38,271.77 232.76,271.77 230.22,274.31 227.68,271.77 221.33,271.77 214.98,265.42 210.54,265.42 v208.95,263.83 | v157.52,263.83 v160.06,261.29 | v150.53,270.81 148.31,273.04 v147.99,272.72 | v137.2,265.1 129.26,273.04 128.62,272.4 126.72,272.4 126.08,271.77 113.38,271.77 113.07,271.45 81.32,271.45 78.14,268.28 76.24,268.28 A23.D2
  Route15 0.254: v281.34,259.38 v283.88,256.85 | v274.36,260.02 271.18,263.19 270.55,263.19 267.37,266.37 v267.05,266.37 | v190.54,266.37 187.68,263.51 186.41,264.78 182.6,264.78 v179.74,267.64 | v166.72,261.29 v173.39,267.96
  Bottom 0.254: v281.34,259.38 281.02,259.07 275.31,259.07 v274.36,260.02 | v267.05,266.37 266.1,265.42 v262.61,265.42 | v206.09,260.97 205.46,261.61 194.66,261.61 194.35,261.29 193.71,261.29 193.08,261.93 193.08,262.56 193.71,263.19 v193.71,264.47 | v179.74,267.64 179.42,267.96 v173.39,267.96 | v166.72,261.29 166.41,261.61 160.37,261.61 v160.06,261.29
!03  (via drill 0.61)
  Top 0.254: v248.96,235.26 248.64,235.57 248.64,236.84 243.88,241.61 v243.24,241.61 | v170.22,251.13 167.04,254.3 164.82,254.3 164.82,254.62 163.87,255.58 v163.87,256.21 | v155.61,260.02 152.12,263.51 152.12,267.96 v150.53,269.55 | v109.89,290.18 105.45,294.63 105.45,295.9 105.13,296.22 62.9,296.22 v62.9,292.09 | v67.35,292.09 76.24,292.09 76.24,273.36 79.41,270.18 79.41,269.55 77.82,267.96 A23.E2
  Route2 0.254: v274.36,240.33 267.05,247.64 265.78,246.37 260.07,246.37 v248.96,235.26 | v184.82,254.3 181.65,257.48 176.88,252.72 171.8,252.72 v170.22,251.13
  Route15 0.254: v280.71,239.7 274.99,239.7 v274.36,240.33 | v243.24,241.61 242.29,241.61 240.07,239.38 239.43,240.02 238.48,240.02 237.84,240.65 235.94,240.65 230.86,245.73 224.51,245.73 221.33,248.91 217.52,248.91 216.25,250.18 216.25,254.62 v214.03,256.85 | v195.62,250.18 195.3,250.18 v191.17,254.3 | v163.87,256.21 163.23,256.21 v160.06,259.38 | v138.15,271.13 132.43,276.85 131.48,276.85 v117.83,290.5
  Bottom 0.254: A07.N1 282.61,239.7 v280.71,239.7 | v214.03,256.85 213.71,256.53 212.44,256.53 211.81,255.89 210.54,255.89 210.22,256.21 205.78,256.21 205.46,255.89 201.01,255.89 200.7,256.21 200.06,256.21 197.84,253.99 197.84,252.08 197.52,252.08 v195.62,250.18 | v191.17,254.3 190.22,255.26 188,255.26 187.04,254.3 v184.82,254.3 | v160.06,259.38 159.74,259.07 156.56,259.07 v155.61,260.02 | v150.53,269.55 148.94,271.13 141.96,271.13 141.64,271.45 138.47,271.45 v138.15,271.13 | v117.83,290.5 117.51,290.18 v109.89,290.18 | v67.35,292.09 v62.9,292.09
!04  (via drill 0.61)
  Top 0.254: A23.K2 76.55,249.54 v76.55,247.96 | v118.15,243.19 117.83,242.87 117.83,240.65 119.42,239.06 v119.42,238.43 | v139.42,252.08 v139.42,244.46 | v165.45,255.26 167.68,255.26 v167.68,254.94 | v190.22,271.13 191.49,271.13 195.3,274.94 207.05,274.94 v207.05,275.9 | v252.13,296.22 v241.97,296.22 | v283.88,264.47 284.2,264.15 A07.F1
  Route2 0.254: v139.42,244.46 v132.12,237.16 | v172.76,254.94 174.34,256.53 174.34,257.16 174.98,257.8 176.88,257.8 v190.22,271.13 | v207.05,275.9 209.27,273.67 209.9,274.31 211.81,274.31 215.94,278.43 220.7,278.43 222.29,280.02 223.56,280.02 236.89,293.36 238.16,293.36 239.11,294.31 240.07,294.31 v241.97,296.22
  Route15 0.254: v90.84,247 91.48,247 v93.7,244.78 | v160.06,253.67 v157.52,251.13 | v283.88,264.47 v252.13,296.22
  Bottom 0.254: v76.55,247.96 77.82,246.68 80.05,246.68 80.36,246.37 89.57,246.37 90.21,247 v90.84,247 | v93.7,244.78 95.29,243.19 105.45,243.19 106.4,244.14 107.99,244.14 108.94,243.19 v118.15,243.19 | v119.42,238.43 120.05,237.8 120.69,237.8 121.64,236.84 124.5,236.84 124.81,237.16 127.67,237.16 127.99,236.84 131.8,236.84 v132.12,237.16 | v139.42,252.08 154.66,252.08 155.61,251.13 v157.52,251.13 | v160.06,253.67 161.64,255.26 v165.45,255.26 | v167.68,254.94 167.99,255.26 172.44,255.26 v172.76,254.94
!05  (via drill 0.61)
  Top 0.254: v71.79,247.96 70.2,249.54 70.2,286.69 v74.65,291.13 | v88.62,293.36 96.87,293.36 96.87,293.99 97.51,294.63 101.64,294.63 101.64,274.31 102.27,273.67 102.27,270.81 101.64,270.18 101.64,268.28 v103.22,266.69 | v119.1,263.51 119.1,264.78 117.83,266.05 v117.83,267.96 | v131.48,265.1 131.8,264.78 131.8,263.51 129.89,261.61 129.89,254.62 v129.58,254.3 | v140.37,247.32 143.23,244.46 143.23,240.65 144.82,239.06 v144.82,237.8 | v154.98,234.94 155.93,234.94 155.93,235.57 v157.52,237.16 | v188.95,239.06 187.68,240.33 187.68,243.19 v188,243.51
  Route2 0.254: v261.66,223.83 262.29,223.83 263.24,224.78 263.24,228.59 274.04,239.38 277.85,239.38 281.02,242.56 282.93,242.56 v283.88,243.51
  Route15 0.254: v129.58,254.3 134.34,249.54 138.15,249.54 v140.37,247.32 | v143.55,236.52 v144.82,237.8 | v157.52,237.16 161.01,240.65 162.28,239.38 162.91,239.38 v163.23,239.06 | v208.95,242.87 215.3,242.87 221.97,236.21 223.87,236.21 226.41,233.67 243.56,233.67 v251.5,225.73
  Bottom 0.254: A23.L2 74.33,247.96 v71.79,247.96 | v74.65,291.13 76.87,293.36 v88.62,293.36 | v103.22,266.69 105.13,264.78 116.56,264.78 117.83,263.51 v119.1,263.51 | v117.83,267.96 127.67,267.96 129.58,266.05 130.53,266.05 v131.48,265.1 | v143.55,236.52 143.86,236.21 153.71,236.21 v154.98,234.94 | v163.23,239.06 163.55,239.38 188.63,239.38 v188.95,239.06 | v188,243.51 188.95,242.56 189.58,242.56 191.49,240.65 194.03,240.65 194.66,240.02 202.6,240.02 204.19,241.61 206.41,241.61 207.68,242.87 v208.95,242.87 | v251.5,225.73 254.35,222.87 257.53,222.87 258.48,223.83 v261.66,223.83 | v283.88,243.51 284.83,244.46 A07.M1
!06  (via drill 0.61)
  Top 0.254: A23.R2 75.28,235.57 75.28,240.02 75.92,240.65 75.92,243.51 74.65,244.78 v74.65,245.73 | v87.03,245.42 88.3,244.14 88.3,242.24 88.62,241.92 88.62,238.11 v88.3,237.8 | v109.26,228.9 109.89,228.27 v109.89,227 | v122.91,227 124.18,225.73 124.18,221.6 125.77,220.02 v125.77,206.68 | v141.96,203.51 143.55,201.92 143.55,197.79 143.23,197.47 143.23,196.2 144.82,194.61 v144.82,193.66 | v175.93,192.39 176.57,193.03 v176.57,195.25 | v218.79,224.14 222.29,227.64 222.29,228.9 221.33,229.86 221.33,233.67 221.97,234.3 221.97,236.21 221.33,236.84 221.33,237.48 v222.29,238.43
  Route2 0.254: v122.91,227 v112.43,227 | v191.81,197.15 191.81,197.79 201.65,207.63 201.65,207.95 214.67,220.97 214.98,220.97 215.62,221.6 215.62,222.24 217.52,224.14 v218.79,224.14 | v222.29,238.43 223.24,239.38 227.68,239.38 229.59,241.29 231.49,241.29 235.94,245.73 237.21,245.73 v238.16,246.68 | v245.46,245.1 248,245.1 v248.96,246.05 | v255.31,246.05 258.16,248.91 264.51,248.91 270.86,255.26 285.47,255.26 A07.H1
  Route15 0.254: v90.84,235.26 v88.3,237.8
  Bottom 0.254: v74.65,245.73 74.97,245.42 76.87,245.42 77.51,246.05 79.73,246.05 80.05,245.73 86.71,245.73 v87.03,245.42 | v90.84,235.26 98.78,227.32 107.67,227.32 v109.26,228.9 | v112.43,227 v109.89,227 | v125.77,206.68 127.35,205.09 130.21,205.09 130.85,205.73 133.7,205.73 134.97,204.46 137.51,204.46 137.83,204.77 138.47,204.77 139.74,203.51 v141.96,203.51 | v144.82,193.66 146.09,192.39 148.63,192.39 149.58,193.34 152.44,193.34 153.39,192.39 v175.93,192.39 | v176.57,195.25 176.88,195.57 190.22,195.57 v191.81,197.15 | v238.16,246.68 239.75,245.1 241.65,245.1 242.29,245.73 243.56,245.73 244.19,245.1 v245.46,245.1 | v255.31,246.05 v248.96,246.05
!07  (via drill 0.61)
  Top 0.254: A23.S2 78.78,232.71 v78.78,234.62 | v73.7,238.43 73.38,238.75 73.38,250.81 76.24,253.67 v76.24,259.07 | v95.29,264.15 v95.29,259.7 | v102.27,265.1 101.95,264.78 101.95,261.61 v102.27,261.29 | v121.96,261.29 123.54,262.88 123.54,284.79 123.23,285.1 v123.23,288.6 | v129.58,289.23 130.21,289.86 130.21,290.82 130.85,291.45 155.93,291.45 155.93,271.13 v157.52,269.55 | v160.06,267 170.22,277.17 v170.22,277.48 | v190.22,277.48 190.54,277.17 190.54,275.9 191.81,274.62 194.03,274.62 195.3,275.9 v195.93,275.9 | v241.34,277.8 247.37,277.8 247.37,275.58 v249.59,273.36
  Route2 0.254: v78.78,234.62 74.33,239.06 v73.7,238.43 | v160.06,267 v157.52,269.55 | v170.22,277.48 174.03,277.48 175.3,278.75 188.95,278.75 v190.22,277.48
  Route15 0.254: v208.32,275.9 211.49,279.07 216.57,273.99 217.84,273.99 220.06,271.77 222.6,271.77 234.99,284.15 v241.34,277.8 | v249.59,273.36 250.23,273.36 255.31,268.28 261.02,268.28 274.67,254.62 274.67,253.99 v280.71,247.96
  Bottom 0.254: v76.24,259.07 94.65,259.07 v95.29,259.7 | v95.29,264.15 96.24,265.1 v102.27,265.1 | v102.27,261.29 102.59,261.61 121.64,261.61 v121.96,261.29 | v123.23,288.6 123.86,289.23 v129.58,289.23 | v195.93,275.9 197.52,277.48 206.73,277.48 v208.32,275.9 | v280.71,247.96 281.02,247.64 A07.L1
!76  (via drill 0.61)
  Top 0.254: D12.R2 D12.S2 | C06.T2 291.18,94.6 291.18,90.16 292.14,89.21 v292.14,84.44 | v294.99,83.81 294.99,74.28 v295.31,73.97 | v297.22,72.06 298.17,71.11 298.17,69.2 297.85,68.88 297.85,64.44 298.17,64.12 298.17,62.85 v297.22,61.9 | v228.95,23.48 228.64,23.8 228.64,26.98 v228,27.61
  Route2 0.254: v297.22,72.06 v295.31,73.97 | v268.01,50.15 266.42,50.15 258.48,42.21 258.16,42.21 256.89,40.95 256.89,40.63 v240.07,23.8
  Bottom 0.254: v292.14,84.44 292.77,83.81 v294.99,83.81 | v297.22,61.9 296.9,61.58 292.45,61.58 289.28,58.41 281.02,58.41 277.85,55.23 272.45,55.23 268.64,51.42 268.64,50.15 v268.01,50.15 | v240.07,23.8 239.75,23.48 234.35,23.48 234.03,23.16 231.18,23.16 230.86,23.48 v228.95,23.48 | v228,27.61 224.83,27.61 224.51,27.29 221.65,27.29 220.38,28.56 D12.S2
!77  (via drill 0.61)
  Top 0.254: D12.T2 217.52,25.39 D12.U2 | C06.V2 291.18,88.25 291.18,75.24 v291.5,74.92 | v267.37,56.82 264.83,54.28 v264.83,52.38 | v252.77,48.57 252.13,47.93 252.13,46.66 249.91,44.44 249.91,43.17 v250.86,42.21 | v240.7,33.96 241.02,33.64 241.02,29.83 239.11,27.93 239.11,26.98 v236.89,24.75
  Route2 0.254: v261.66,52.38 259.43,52.38 259.12,52.06 256.26,52.06 v252.77,48.57 | v245.78,41.58 244.83,40.63 244.83,39.99 243.24,38.4 243.24,37.14 241.65,35.55 241.65,34.91 v240.7,33.96
  Route15 0.254: v274.99,64.12 v280.71,69.84
  Bottom 0.254: v291.5,74.92 291.18,74.6 285.47,74.6 v280.71,69.84 | v274.99,64.12 267.69,56.82 v267.37,56.82 | v261.66,52.38 v264.83,52.38 | v250.86,42.21 250.54,42.53 246.73,42.53 v245.78,41.58 | v236.89,24.75 236.26,24.12 234.03,24.12 233.72,23.8 231.49,23.8 230.86,24.44 228,24.44 227.05,23.48 220.06,23.48 218.79,22.21 D12.U2
!ADDR_ACC  (via drill 0.61)
  Top 0.254: C17.P1 162.28,102.86 162.28,100.63 163.87,99.05 v163.87,98.73 | v254.67,157.79 254.67,156.52 254.35,156.2 254.35,154.29 255.62,153.02 255.62,152.39 v256.58,151.43
  Route2 0.254: v194.35,116.51 194.66,116.51 198.47,120.32 199.43,120.32 204.19,125.08 210.54,125.08 216.89,131.43 220.7,131.43 224.83,127.3 225.14,127.62 225.78,127.62 226.41,128.26 230.22,128.26 231.49,129.53 231.49,133.34 250.86,152.71 250.86,153.34 v252.13,154.61 | v261.02,151.43 261.02,152.71 263.24,154.93 263.24,156.83 B08.T2
  Route15 0.254: v163.87,98.73 167.36,102.22 v167.04,102.54 | v173.39,102.86 175.93,105.4 177.2,105.4 188,116.19 188.31,115.88 v188.63,115.88
  Bottom 0.254: v167.04,102.54 167.36,102.86 v173.39,102.86 | v188.63,115.88 189.27,116.51 191.17,116.51 191.49,116.19 194.03,116.19 v194.35,116.51 | v252.13,154.61 253.4,155.88 254.04,155.88 254.67,156.52 v254.67,157.79 | v256.58,151.43 256.89,151.12 260.7,151.12 v261.02,151.43
!B-BRK  (via drill 0.61)
  Top 0.254: B02.C1 350.56,199.7 v350.56,196.2 | v341.03,153.98 341.35,154.29 B02.T2
  Bottom 0.254: B02.M2 345.16,173.98 346.43,173.98 | 346.43,173.98 347.06,173.98 350.87,170.17 B02.P1 350.24,167.63 348.33,167.63 342.94,162.23 342.94,158.74 B02.T2 | 346.43,182.87 B02.J1 | 346.43,173.98 346.43,182.87 | 346.43,182.87 342.62,186.68 341.35,186.68 B02.F2 344.21,190.49 346.11,192.39 347.06,192.39 348.33,193.66 348.33,193.98 v350.56,196.2 | B10.V2 242.92,149.21 322.93,149.21 323.25,149.53 335.95,149.53 339.13,152.71 339.76,152.71 v341.03,153.98
!BAC_00  (via drill 0.61)
  Top 0.254: D10.F1 244.83,55.87 244.83,48.25 244.19,47.61 v244.19,38.09 | v241.97,37.14 241.65,36.82 v241.65,10.46 | v120.05,11.1 120.37,11.42 120.37,201.28 120.05,201.6 120.05,202.24 120.69,202.87 v120.69,206.68 | v136.56,207.31 136.24,207.63 136.24,267.96 136.88,268.59 136.88,272.4 136.56,272.72 136.56,273.36 136.88,273.67 v136.88,288.28 | v316.27,288.6 314.68,287.01 314.68,269.86 317.22,267.32 317.22,260.97 317.54,260.66 317.54,258.43 317.22,258.11 317.22,254.62 317.54,254.3 317.54,227.64 v316.9,227 | v313.73,223.83 314.04,223.51 314.04,220.65 315.31,219.38 315.31,205.41 313.73,203.82 v313.73,203.19 | B06.A1 v300.07,201.92 | C03.B1 334.05,140.64 334.05,149.53 337.22,152.71 v337.22,153.34 | v360.08,156.52 361.99,158.42 361.99,159.37 361.35,160.01 361.35,164.14 361.67,164.45 361.67,173.98 v361.35,174.3 | v363.26,179.06 v363.26,176.2 | v348.65,192.71 348.97,193.03 348.97,197.47 347.7,198.74 v347.38,198.74
  Route15 0.254: v353.73,186.68 350.56,189.85 350.56,190.8 v348.65,192.71 | v347.38,198.74 347.38,199.06 v343.89,202.55
  Bottom 0.254: v244.19,38.09 243.24,37.14 v241.97,37.14 | v241.65,10.46 241.34,10.15 126.08,10.15 125.45,10.78 121.64,10.78 121.32,11.1 v120.05,11.1 | v120.69,206.68 121.64,207.63 136.24,207.63 v136.56,207.31 | v136.88,288.28 137.2,287.96 147.99,287.96 148.94,288.91 150.21,288.91 150.85,288.28 176.25,288.28 177.52,289.55 185.77,289.55 186.41,288.91 209.9,288.91 210.54,289.55 215.62,289.55 216.57,288.6 218.79,288.6 220.38,287.01 267.37,287.01 268.01,287.64 274.36,287.64 274.99,288.28 275.94,288.28 276.58,288.91 278.48,288.91 279.75,287.64 294.36,287.64 294.99,288.28 315.95,288.28 v316.27,288.6 | v313.73,223.83 v316.9,227 | v300.07,201.92 303.88,201.92 304.2,202.24 308.01,202.24 308.33,201.92 312.46,201.92 v313.73,203.19 315,204.46 341.98,204.46 v343.89,202.55 | v337.22,153.34 339.13,153.34 340.71,154.93 343.25,154.93 343.89,154.29 345.16,154.29 345.48,154.61 349.92,154.61 350.56,153.98 352.78,153.98 353.1,154.29 357.86,154.29 v360.08,156.52 | v363.26,176.2 v361.35,174.3 | v363.26,179.06 361.35,180.96 360.72,180.96 355,186.68 v353.73,186.68
!BAC_01  (via drill 0.61)
  Top 0.254: D10.H1 249.27,57.14 250.54,58.41 250.54,69.2 v250.23,69.52 | v256.58,70.79 256.89,71.11 256.89,72.38 257.53,73.01 257.53,81.58 v257.21,81.9 | v271.5,85.39 v271.5,81.9 | v329.6,83.81 329.92,84.13 329.92,92.7 v329.6,93.02 | v332.78,96.51 333.09,96.83 333.09,112.38 v332.14,113.33 | v288.33,202.87 288.64,203.19 288.64,224.78 288.96,225.09 288.96,227.32 286.1,230.18 v286.1,234.94 | v285.79,237.48 285.47,237.8 285.47,284.15 v280.39,289.23 | v120.37,236.84 v120.37,290.82 | v116.88,236.52 117.19,236.21 117.19,207 117.51,206.68 117.51,204.46 117.19,204.14 117.19,200.65 117.51,200.33 117.51,198.11 117.19,197.79 117.19,163.5 117.83,162.86 117.83,150.48 118.15,150.17 118.15,140.64 117.83,140.32 v117.83,78.73 | v171.49,66.35 v171.49,79.05
  Route2 0.254: v329.6,93.02 329.6,93.33 v332.78,96.51 | v332.14,113.33 335.63,116.83 335.63,119.37 336.27,120 336.27,121.91 336.9,122.54 336.9,128.89 C03.E1 | v288.33,202.87 v293.09,198.11
  Route15 0.254: v229.91,63.81 229.91,63.17 v231.18,61.9
  Bottom 0.254: v250.23,69.52 251.81,71.11 253.08,71.11 253.4,70.79 v256.58,70.79 | v257.21,81.9 257.53,82.22 269.91,82.22 270.23,81.9 v271.5,81.9 | v271.5,85.39 271.82,85.08 284.52,85.08 284.83,85.39 295.31,85.39 297.53,83.17 324.52,83.17 325.16,83.81 v329.6,83.81 | B06.D1 295.63,198.11 v293.09,198.11 | v286.1,234.94 286.1,237.48 v285.79,237.48 | v280.39,289.23 279.44,290.18 275.63,290.18 274.99,289.55 274.36,289.55 273.72,288.91 267.37,288.91 266.74,288.28 221.02,288.28 219.43,289.86 217.21,289.86 216.25,290.82 209.9,290.82 209.27,290.18 187.04,290.18 186.41,290.82 176.88,290.82 175.61,289.55 151.48,289.55 150.21,290.82 v120.37,290.82 | v120.37,236.84 117.19,236.84 v116.88,236.52 | v117.83,78.73 118.15,79.05 154.66,79.05 154.98,78.73 164.5,78.73 165.14,79.36 168.31,79.36 168.95,78.73 171.17,78.73 v171.49,79.05 | v171.49,66.35 172.44,65.39 178.79,65.39 179.11,65.08 179.74,65.08 180.06,65.39 191.49,65.39 191.81,65.08 192.44,65.08 192.76,65.39 204.19,65.39 204.51,65.08 205.78,65.08 206.09,65.39 216.89,65.39 217.52,64.76 222.29,64.76 224.83,62.22 228.32,62.22 v229.91,63.81 | v231.18,61.9 234.03,59.04 234.99,59.04 235.62,58.41 241.65,58.41 246.1,53.96 D10.H1
!BAC_02  (via drill 0.61)
  Top 0.254: v254.67,52.38 254.35,52.69 254.35,57.77 v254.67,58.09 | v273.72,64.76 273.4,64.44 273.4,59.68 v274.67,58.41 | v291.5,65.39 291.18,65.71 v291.18,67.93 | v363.57,77.14 364.21,77.77 364.21,89.84 v363.89,90.16 | v357.54,101.27 355.95,102.86 355.95,107.3 v356.91,108.25 | v286.42,202.24 286.1,202.55 286.1,223.51 v284.52,225.09 | v277.53,226.68 276.58,227.64 v276.58,231.45 | v278.17,232.71 279.12,233.67 279.12,268.91 278.8,269.23 278.8,272.09 279.12,272.4 279.12,275.26 278.48,275.9 278.48,287.01 274.99,290.5 v274.67,290.5 | v121.32,291.77 121.32,288.6 121,288.28 121,237.48 121.32,237.16 121.32,232.71 120.37,231.76 v120.37,225.09 | v118.15,224.78 117.83,224.46 117.83,207.31 118.15,207 118.15,204.14 117.83,203.82 117.83,200.96 118.15,200.65 118.15,197.79 117.83,197.47 117.83,163.82 118.78,162.86 v118.78,160.64 | v116.24,158.1 114.65,156.52 114.65,150.8 117.19,148.26 117.19,79.36 116.88,79.05 116.88,75.55 117.83,74.6 117.83,13.32 v118.15,13.01 | v270.55,13.32 272.77,15.54 272.77,24.75 273.4,25.39 v273.4,30.78 | v277.53,33.96 279.75,36.18 v279.75,58.72
  Route15 0.254: v360.08,92.06 360.08,92.7 359.76,93.02 359.76,93.97 358.81,94.92 358.81,100 v357.54,101.27 | v356.91,108.25 356.91,108.89 355.64,110.16 v354.37,110.16 | v345.48,114.61 340.08,120 340.08,121.91 C03.H1 | B06.F1 294.99,190.49 291.82,193.66 291.82,193.98 290.23,195.57 289.91,195.57 286.1,199.38 286.1,201.92 v286.42,202.24
  Bottom 0.254: D10.J1 247.37,52.06 254.35,52.06 v254.67,52.38 | v254.67,58.09 255.62,59.04 256.26,59.04 261.34,64.12 263.88,64.12 264.51,64.76 v273.72,64.76 | v274.67,58.41 275.31,59.04 279.75,59.04 | 279.75,59.04 282.29,59.04 288.64,65.39 v291.5,65.39 | v291.18,67.93 298.49,75.24 311.19,75.24 311.82,75.87 328.65,75.87 330.55,77.77 331.19,77.77 331.82,77.14 344.21,77.14 344.84,77.77 348.02,77.77 349.29,76.5 361.67,76.5 362.3,77.14 v363.57,77.14 | v363.89,90.16 363.26,90.79 361.35,90.79 v360.08,92.06 | v354.37,110.16 355.32,111.11 355.32,112.38 352.14,112.38 350.87,113.65 348.97,113.65 348.33,113.02 347.06,113.02 v345.48,114.61 | v284.52,225.09 282.93,226.68 v277.53,226.68 | v276.58,231.45 277.85,232.71 v278.17,232.71 | v274.67,290.5 274.36,290.18 274.04,290.18 273.4,289.55 267.05,289.55 266.42,288.91 221.33,288.91 219.75,290.5 217.52,290.5 216.57,291.45 209.59,291.45 208.95,290.82 187.36,290.82 186.73,291.45 176.57,291.45 175.3,290.18 151.8,290.18 150.53,291.45 121.64,291.45 v121.32,291.77 | v120.37,225.09 120.05,224.78 v118.15,224.78 | v116.24,158.1 v118.78,160.64 | v118.15,13.01 118.46,12.69 120.69,12.69 121,12.37 121.96,12.37 122.27,12.05 126.08,12.05 126.72,11.42 240.38,11.42 241.02,12.05 260.7,12.05 261.97,13.32 v270.55,13.32 | v273.4,30.78 274.36,31.74 275.31,31.74 v277.53,33.96 | 279.75,59.04 v279.75,58.72
!BAC_03  (via drill 0.61)
  Top 0.254: D10.K1 250.54,48.88 250.54,55.87 v250.23,56.18 | v268.01,70.79 269.91,72.69 269.91,78.41 269.59,78.73 v269.59,80.63 | v280.07,80.95 280.39,80.63 v280.39,76.19 | v322.93,77.77 323.57,78.41 323.57,94.6 323.89,94.92 323.89,97.14 321.98,99.05 v321.98,100 | v362.62,160.01 362.62,156.52 362.3,156.2 362.3,154.29 362.62,153.98 362.62,152.07 v361.35,150.8 | v362.94,147.94 362.62,147.62 362.62,143.81 362.3,143.5 362.3,135.88 v363.89,134.29 | v361.35,128.89 361.67,128.58 361.67,123.18 v361.35,122.86
  Route2 0.254: v321.98,100 320.08,101.91 329.6,111.43 329.6,112.07 v334.68,117.14 | v361.35,150.8 361.35,149.85 362.94,148.26 v362.94,147.94 | v344.21,119.69 342.3,119.69 341.98,119.37 340.08,119.37 C03.K1
  Route15 0.254: v252.45,65.39 256.58,69.52 v257.21,68.88 | v300.71,184.14 301.34,184.14 302.61,182.87 306.74,182.87 v315.63,173.98 | v322.62,174.3 322.93,174.3 v334.36,162.86 | v344.21,160.33 v341.98,162.55
  Bottom 0.254: v250.23,56.18 250.23,58.09 251.18,59.04 251.18,65.08 252.13,65.08 v252.45,65.39 | v257.21,68.88 257.53,68.57 265.78,68.57 v268.01,70.79 | v269.59,80.63 269.91,80.95 v280.07,80.95 | v280.39,76.19 280.71,75.87 310.87,75.87 311.5,76.5 321.66,76.5 v322.93,77.77 | v334.68,117.14 335,117.46 C03.K1 | v300.71,184.14 B06.J1 | v315.63,173.98 316.27,173.34 321.66,173.34 v322.62,174.3 | v334.36,162.86 334.68,163.18 341.35,163.18 v341.98,162.55 | v344.21,160.33 344.52,160.64 361.99,160.64 v362.62,160.01 | v363.89,134.29 365.16,133.02 368.65,133.02 369.29,132.39 369.29,128.89 v361.35,128.89 | v361.35,122.86 360.4,121.91 357.22,121.91 354.68,119.37 344.52,119.37 v344.21,119.69
!BAC_04  (via drill 0.61)
  Top 0.254: v245.15,47.29 244.83,46.98 244.83,41.26 v245.78,40.31 | v252.45,34.6 253.72,33.32 253.72,16.5 v254.67,15.54 | v360.4,17.13 372.15,28.88 v372.15,71.11 | v294.36,177.15 293.41,178.11 v293.41,179.37 | v281.98,185.41 281.34,186.04 280.07,186.04 280.07,186.36 279.75,186.68 279.75,187.95 280.07,188.27 v280.07,191.44 | v271.82,204.77 272.13,205.09 272.13,215.57 271.82,215.89 271.82,220.65 272.77,221.6 272.77,227.95 273.09,228.27 273.09,230.49 272.45,231.13 v272.45,233.35 | v280.07,233.67 279.75,233.99 279.75,269.23 279.44,269.55 279.44,271.77 279.75,272.09 279.75,275.58 279.44,275.9 v279.44,292.09 | v98.78,292.72 98.46,292.41 98.46,272.72 98.78,272.4 98.78,262.24 98.14,261.61 98.14,204.14 97.83,203.82 97.83,200.96 98.14,200.65 98.14,156.2 98.46,155.88 98.46,153.66 98.14,153.34 v98.14,15.86
  Route15 0.254: v248.96,37.14 v245.78,40.31 | v360.08,90.79 359.13,91.74 359.13,92.38 v350.87,100.63 | v345.48,101.91 340.08,107.3 340.08,109.21 C03.M1 | v293.41,179.37 291.18,181.6 289.91,181.6 v286.42,185.09 | v271.82,199.7 v280.07,191.44
  Bottom 0.254: D10.K2 243.24,47.29 v245.15,47.29 | v248.96,37.14 251.5,34.6 v252.45,34.6 | v360.4,17.13 357.54,14.27 323.89,14.27 323.25,13.64 296.9,13.64 296.58,13.32 274.99,13.32 273.4,14.91 255.31,14.91 v254.67,15.54 254.35,15.54 251.5,12.69 240.7,12.69 240.07,12.05 127.04,12.05 126.4,12.69 122.59,12.69 122.27,13.01 121.32,13.01 121,13.32 119.1,13.32 118.46,13.96 100.05,13.96 v98.14,15.86 | v372.15,71.11 372.15,72.69 371.83,73.01 371.83,89.21 361.99,89.21 360.4,90.79 v360.08,90.79 | v350.87,100.63 350.56,100.32 347.06,100.32 v345.48,101.91 | B06.L1 296.26,177.15 v294.36,177.15 | v286.42,185.09 286.1,185.41 v281.98,185.41 | v271.82,199.7 272.77,200.65 272.77,204.77 v271.82,204.77 | v272.45,233.35 272.77,233.67 v280.07,233.67 | v279.44,292.09 278.17,292.09 277.53,291.45 274.36,291.45 273.09,290.18 266.74,290.18 266.1,289.55 221.65,289.55 220.06,291.13 217.84,291.13 216.89,292.09 209.27,292.09 208.63,291.45 187.68,291.45 187.04,292.09 176.25,292.09 174.98,290.82 152.12,290.82 150.85,292.09 122.27,292.09 121.64,292.72 v98.78,292.72
!BAC_05  (via drill 0.61)
  Top 0.254: v323.25,117.14 323.57,117.46 323.57,121.91 321.66,123.81 v321.66,124.77 | v303.25,142.55 302.61,143.18 302.61,151.12 301.98,151.75 301.98,153.02 303.25,154.29 303.25,156.2 v302.3,157.15 | v295.95,160.33 296.26,160.64 296.26,163.82 295.63,164.45 295.63,166.99 296.9,168.26 B06.N1
  Route2 0.254: v302.3,157.15 299.12,160.33 298.49,159.69 297.85,159.69 296.58,160.96 v295.95,160.33
  Route15 0.254: C03.P1 334.05,104.76 324.52,114.29 324.52,115.88 v323.25,117.14 | v321.66,124.77 321.03,124.77 v303.25,142.55
!BAC_06  (via drill 0.61)
  Top 0.254: C03.S1 337.86,98.73 v337.86,102.54 | v303.88,135.24 304.2,135.56 304.2,138.74 304.52,139.05 304.52,141.91 304.2,142.23 304.2,150.8 v304.84,151.43 | v298.8,151.43 298.17,152.07 298.17,158.1 298.49,158.42 298.49,159.05 296.9,160.64 B06.R1
  Route15 0.254: v341.03,105.08 341.03,105.4 339.44,106.99 339.44,107.94 335.63,111.75 335,111.75 325.47,121.27 323.57,121.27 316.58,128.26 312.77,128.26 v306.74,134.29
  Bottom 0.254: v337.86,102.54 336.9,103.49 336.9,105.72 337.22,105.72 337.54,106.03 340.08,106.03 v341.03,105.08 | v306.74,134.29 305.79,135.24 v303.88,135.24 | v304.84,151.43 304.52,151.12 299.12,151.12 v298.8,151.43
!BAC_07  (via drill 0.61)
  Top 0.254: v336.9,148.26 335,146.36 v335,145.08 | v316.9,150.48 v316.9,145.72
  Route15 0.254: v343.89,93.97 343.89,94.92 353.1,104.13 v353.1,104.44 | v356.91,113.97 v354.37,111.43 | v310.55,150.8 308.65,150.8 v305.79,153.66
  Bottom 0.254: C03.U1 338.81,92.7 342.62,92.7 v343.89,93.97 | v353.1,104.44 350.87,106.67 347.06,106.67 346.43,107.3 346.43,108.89 346.75,108.89 347.7,109.84 352.78,109.84 v354.37,111.43 | v356.91,113.97 359.13,116.19 368.97,116.19 371.83,119.05 371.83,149.85 360.72,149.85 359.76,150.8 339.44,150.8 v336.9,148.26 | v335,145.08 334.05,146.04 317.22,146.04 v316.9,145.72 | v316.9,150.48 316.27,151.12 310.87,151.12 v310.55,150.8 | v305.79,153.66 298.17,153.66 B06.V1
!BAC_08  (via drill 0.61)
  Top 0.254: v328.65,130.48 C03.F2 | v344.21,149.53 345.16,150.48 v345.16,153.34 | v328.97,198.43 328.33,199.06 v328.33,201.28 | v319.44,203.51 319.76,203.82 319.76,205.09 320.71,206.05 320.71,217.48 v320.08,218.11 | v303.57,207.63 v303.57,219.06
  Route2 0.254: v328.65,130.48 328.65,131.43 336.27,139.05 336.27,139.69 337.54,140.96 338.17,140.96 339.44,142.23 339.44,144.77 v344.21,149.53
  Route15 0.254: v345.16,182.87 v356.91,171.12 | v335.32,188.27 337.22,190.17 v328.97,198.43 | v303.57,207.63 303.57,206.05 v305.79,203.82
  Bottom 0.254: v345.16,153.34 345.79,153.98 349.6,153.98 350.24,153.34 353.1,153.34 353.41,153.66 359.76,153.66 363.89,157.79 364.21,157.79 364.84,158.42 364.84,166.99 361.67,166.99 357.54,171.12 v356.91,171.12 | v345.16,182.87 341.98,186.04 337.54,186.04 v335.32,188.27 | v328.33,201.28 327.06,202.55 323.57,202.55 322.93,201.92 321.03,201.92 v319.44,203.51 | v320.08,218.11 319.12,219.06 v303.57,219.06 | v305.79,203.82 305.15,204.46 301.34,204.46 299.12,202.24 299.12,200.01 B06.C1
!BAC_09  (via drill 0.61)
  Top 0.254: v328.65,124.13 C03.J2 | v281.98,177.47 282.29,177.79 v282.29,179.06
  Route2 0.254: v282.29,179.06 283.88,180.64 283.88,181.28 287.37,184.77 287.37,185.41 291.82,189.85 291.82,191.76 B06.E2
  Route15 0.254: v328.65,124.13 307.06,145.72 306.74,145.72 300.71,151.75 300.71,153.02 292.45,161.28 292.45,165.09 282.29,175.25 282.29,177.15 v281.98,177.47
!BAC_10  (via drill 0.61)
  Top 0.254: v316.9,105.72 317.22,105.4 317.22,98.73 v316.9,98.41 | v316.9,91.11 318.49,89.52 318.49,79.36 v318.17,79.05 | v258.16,6.02 251.5,12.69 v251.5,13.96 | v97.19,18.09 91.79,23.48 91.79,159.37 92.43,160.01 92.43,172.07 94.65,174.3 94.65,176.83 94.97,177.15 94.97,220.65 95.6,221.29 95.6,258.11 97.51,260.02 97.51,262.24 98.14,262.88 98.14,272.09 95.6,274.62 95.6,291.13 97.83,293.36 v97.83,293.68 | v238.48,291.13 238.48,267.96 A10.D2 | B06.H2 293.72,191.76 294.99,193.03 294.99,194.93 v293.41,196.52 | v291.18,198.74 291.5,199.06 291.5,202.24 291.82,202.55 291.82,205.41 291.5,205.73 291.5,209.86 292.45,210.81 292.45,214.3 v292.14,214.62 | v303.88,226.68 304.52,227.32 304.52,234.3 304.84,234.62 304.84,236.84 304.52,237.16 304.52,240.65 304.84,240.97 304.84,243.19 304.52,243.51 304.52,247 304.84,247.32 304.84,249.54 304.52,249.86 304.52,253.35 304.84,253.67 304.84,255.89 304.52,256.21 304.52,259.7 304.84,260.02 304.84,262.24 304.52,262.56 304.52,266.05 304.84,266.37 304.84,268.59 301.98,271.45 301.98,275.26 302.61,275.9 v302.61,293.04
  Route2 0.254: v325.79,114.29 325.79,113.33 323.57,111.11 323.57,110.8 321.98,109.21 321.66,109.21 v320.08,107.62 | v316.9,98.41 316.9,96.19 319.12,93.97 317.85,92.7 317.85,92.06 v316.9,91.11 | v292.14,214.62 300.71,223.19 300.71,223.51 v303.88,226.68
  Bottom 0.254: v325.79,114.29 C03.L2 | v320.08,107.62 319.76,107.3 318.49,107.3 v316.9,105.72 | v318.17,79.05 318.49,79.36 325.79,79.36 326.11,79.05 327.06,79.05 327.7,78.41 331.51,78.41 332.14,77.77 343.89,77.77 344.52,78.41 348.33,78.41 349.6,77.14 361.35,77.14 362.3,78.09 366.11,78.09 371.19,73.01 371.19,70.16 372.46,70.16 372.78,69.84 372.78,13.64 326.74,13.64 324.52,11.42 301.98,11.42 301.66,11.74 301.03,11.74 299.76,10.46 299.76,5.7 267.69,5.7 267.05,5.07 259.12,5.07 v258.16,6.02 | v251.5,13.96 250.86,13.32 240.38,13.32 239.75,12.69 127.35,12.69 126.72,13.32 122.91,13.32 122.59,13.64 121.64,13.64 121.32,13.96 119.42,13.96 118.78,14.59 100.68,14.59 v97.19,18.09 | v97.83,293.68 98.78,294.63 100.05,294.63 100.68,293.99 122.27,293.99 122.91,293.36 151.48,293.36 152.75,292.09 174.34,292.09 175.61,293.36 187.68,293.36 188.31,292.72 208,292.72 208.63,293.36 217.52,293.36 218.48,292.41 220.7,292.41 222.29,290.82 238.16,290.82 | v291.18,198.74 v293.41,196.52 | v302.61,293.04 301.98,293.68 278.8,293.68 278.48,293.36 274.36,293.36 272.45,291.45 266.1,291.45 265.47,290.82 238.16,290.82 | 238.16,290.82 v238.48,291.13
!BAC_11  (via drill 0.61)